# EAGLE design Versie 5 (EAGLE 7.3.0)

## Sheet 1 of 7: OVERVIEW
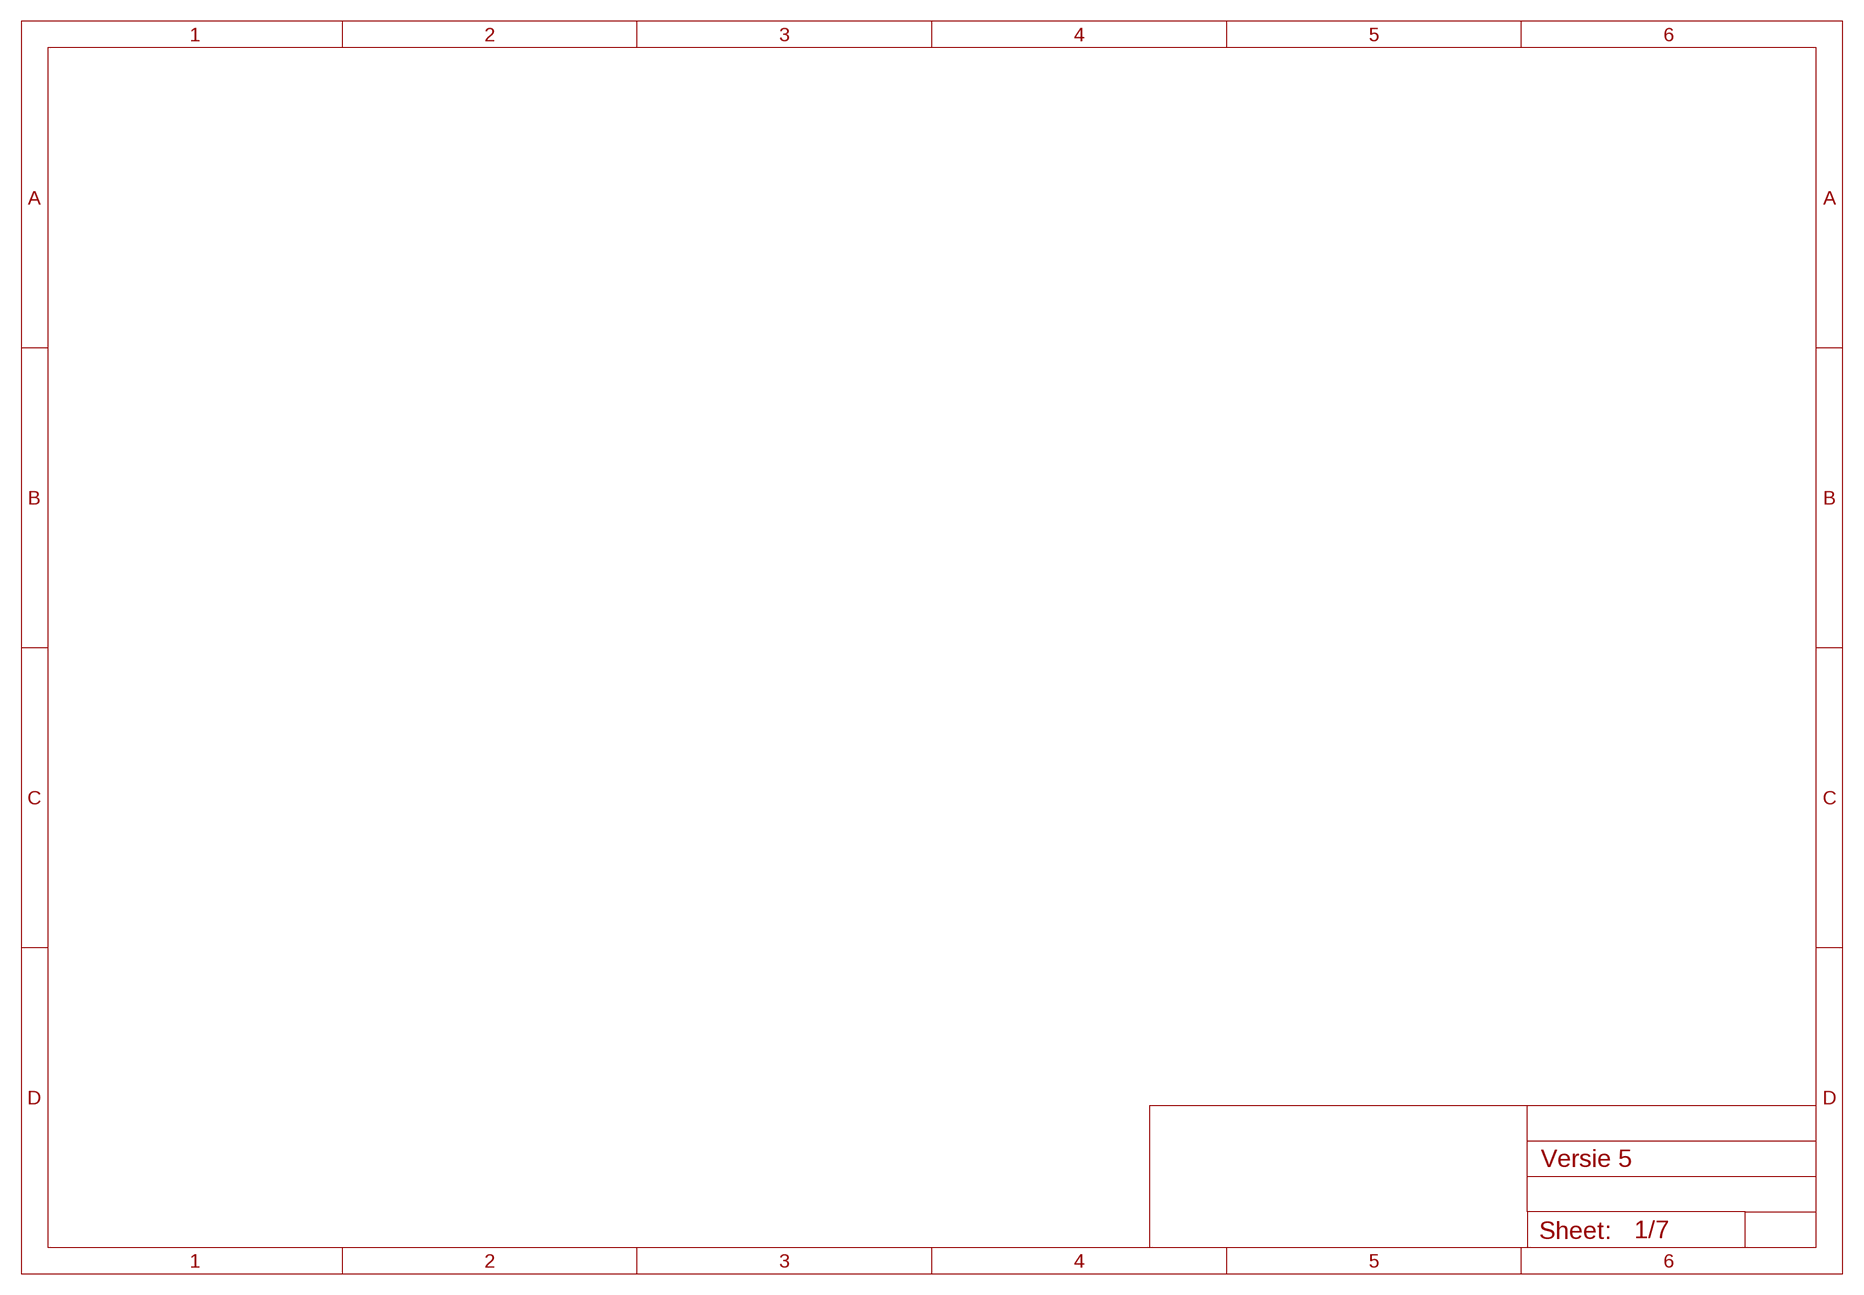
[diagram p0: schematic, sheet 1]

## Sheet 2 of 7: POWER
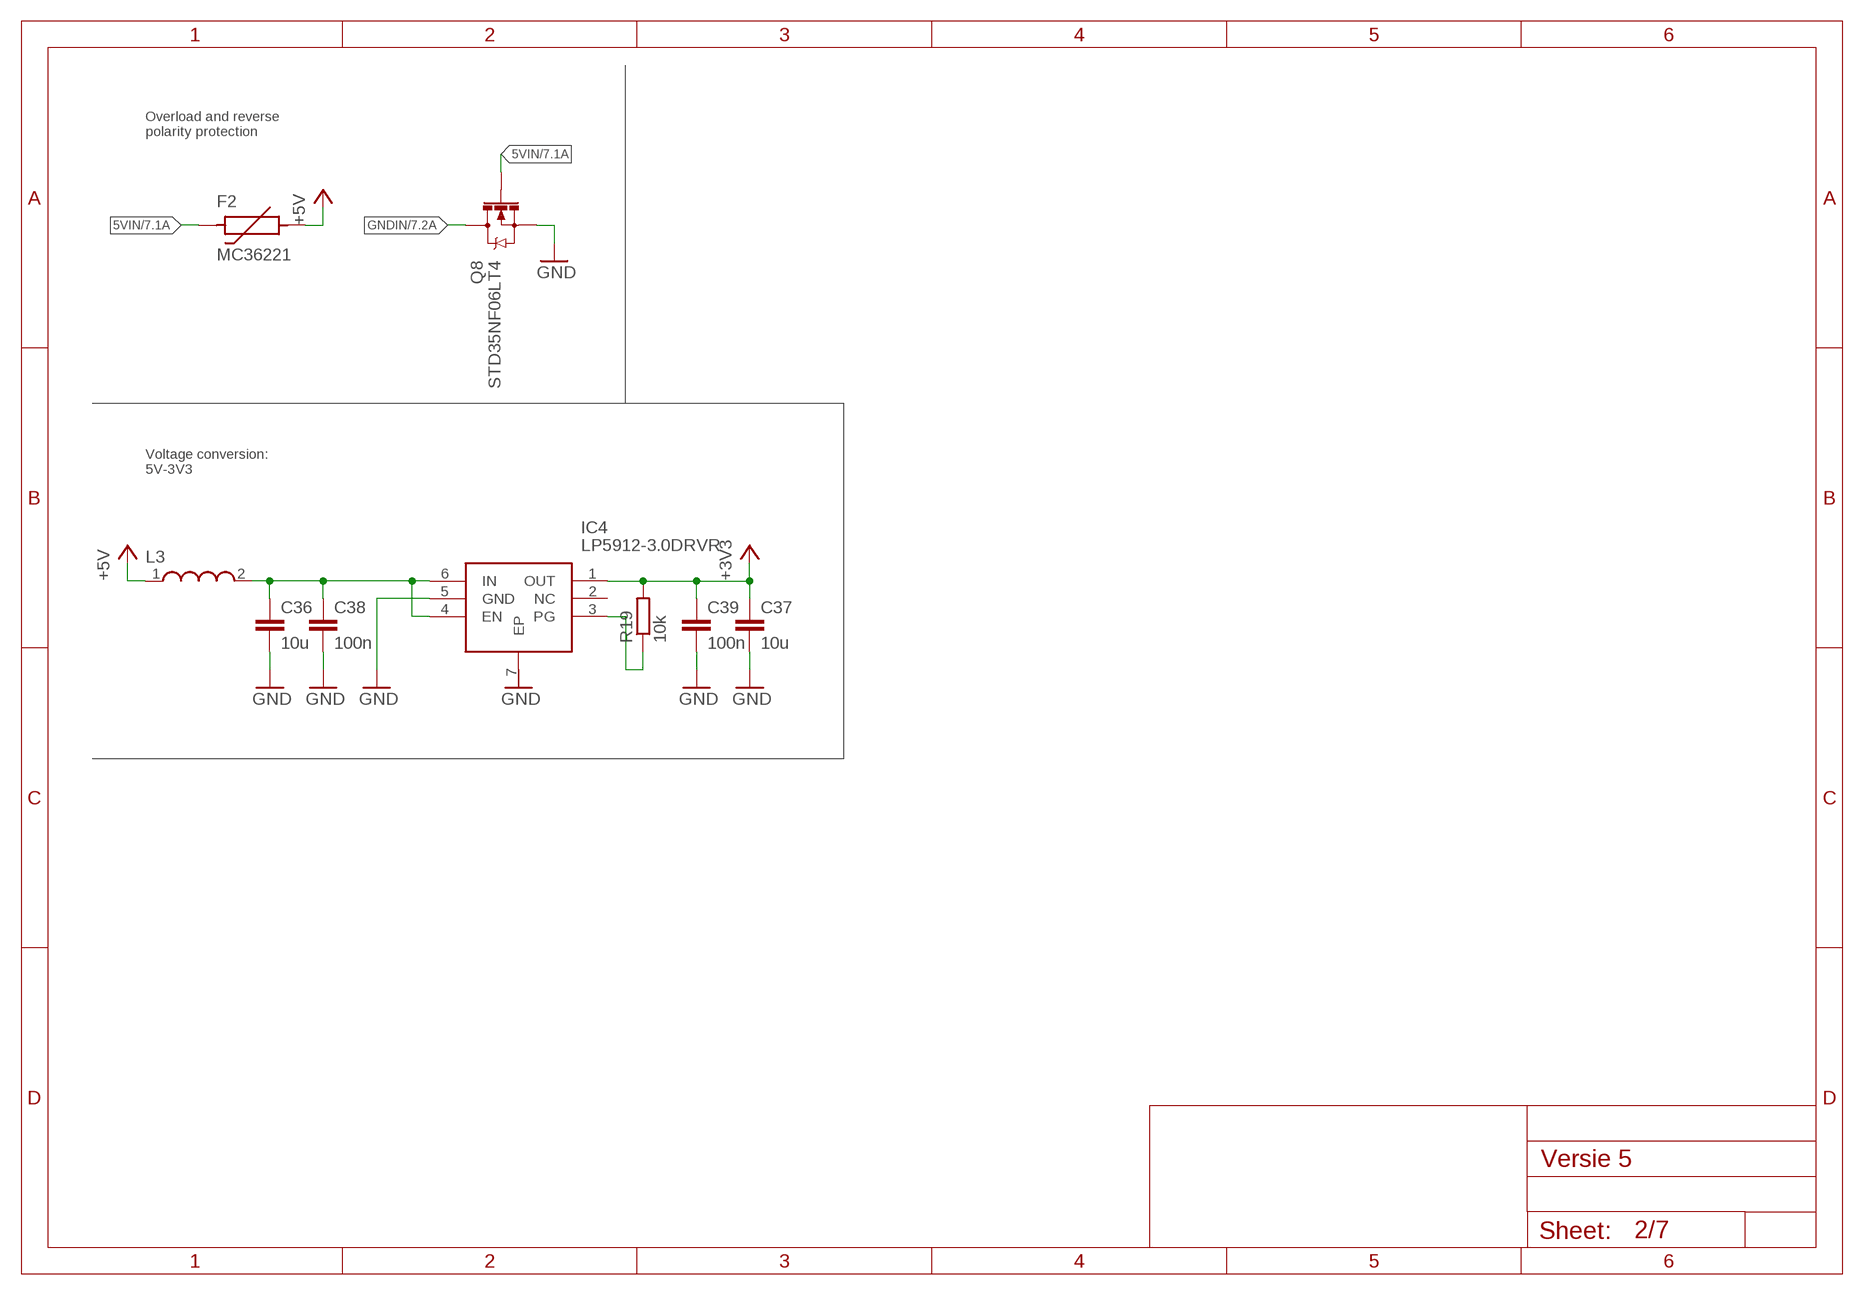
[diagram p1: schematic, sheet 2]

### Parts
C36  10u  C-EUC0603  [C0603]
C37  10u  C-EUC0603  [C0603]
C38  100n  C-EUC0603  [C0603]
C39  100n  C-EUC0603  [C0603]
F2  MC36221  [1206]
IC4  LP5912-3.0DRVR  [SON65P200X200X80-7N]
L3  WE-CBA_0603(WB/HS)  [WE-CBA_0603(W=2.2)]
Q8  STD35NF06LT4  MOSFET-NCHANNEL_SOT23-3  [SOT23-3]
R19  10k  R-EU_R0603  [R0603]

### Nets
5VIN: F2.P$1 Q8.1(G) ; also sheet 7
+3V3: C37.1 C39.1 IC4.1(OUT) R19.2 ; also sheet 3,4,5,6,7
+5V: F2.P$2 L3.1
GND: C36.2 C37.2 C38.2 C39.2 IC4.5(GND) Q8.2(S) ; also sheet 3,4,5,6,7
GNDIN: Q8.3(D) ; also sheet 7
N$28: C36.1 C38.1 IC4.4(EN) IC4.6(IN) L3.2
N$29: IC4.3(PG) R19.1
Unconnected: IC4.2(NC) IC4.7(EP)

### Notes on the sheet
- Overload and reverse
  polarity protection
- Voltage conversion:
  5V-3V3

## Sheet 3 of 7: PPS IN
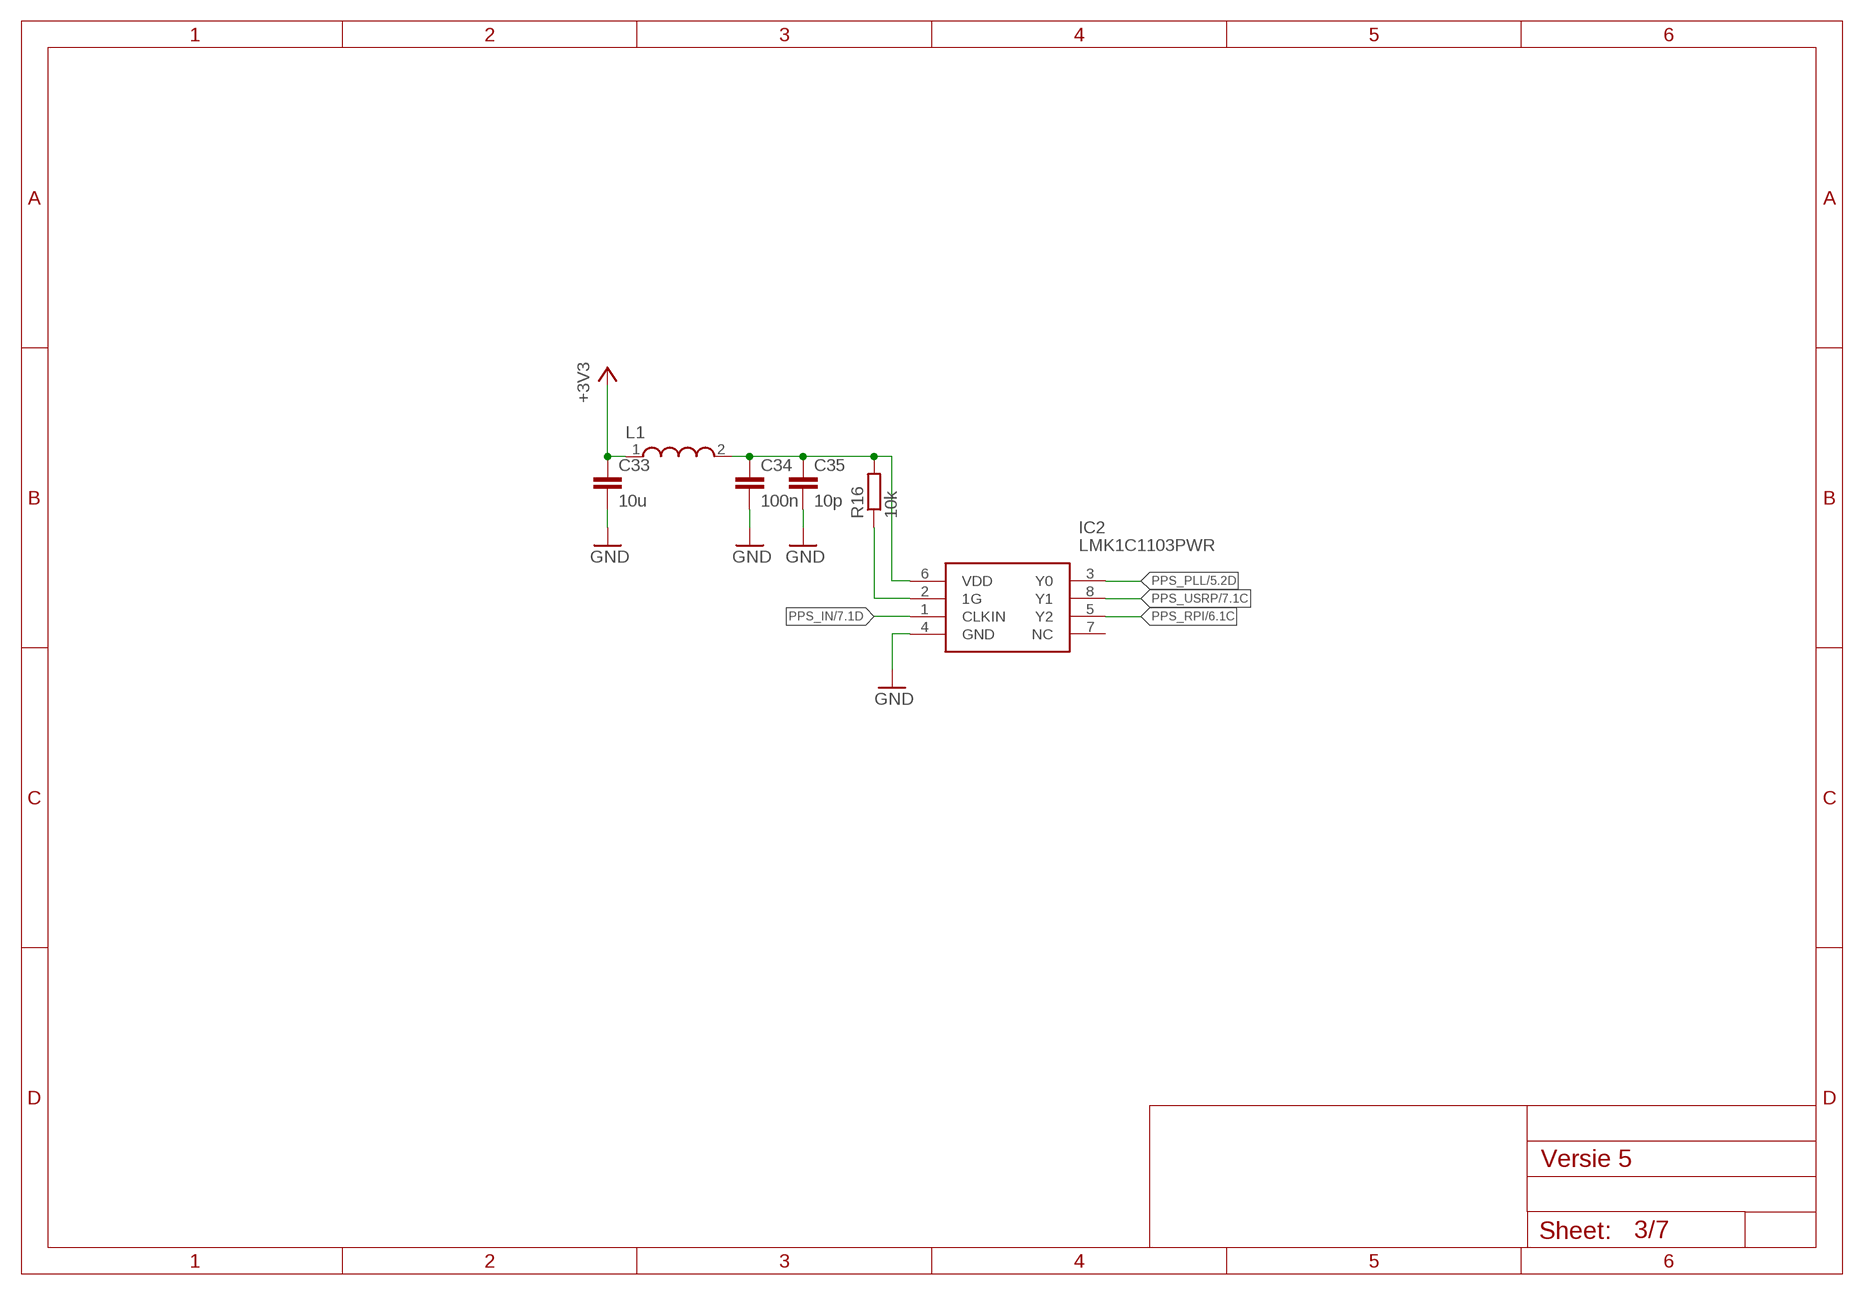
[diagram p2: schematic, sheet 3]

### Parts
C33  10u  C-EUC0603  [C0603]
C34  100n  C-EUC0603  [C0603]
C35  10p  C-EUC0603  [C0603]
IC2  LMK1C1103PWR  [SOP65P640X120-8N]
L1  WE-CBA_0603(WB/HS)  [WE-CBA_0603(W=2.2)]
R16  10k  R-EU_R0603  [R0603]

### Nets
+3V3: C33.1 L1.1 ; also sheet 2,4,5,6,7
GND: C33.2 C34.2 C35.2 IC2.4(GND) ; also sheet 2,4,5,6,7
N$22: IC2.2(1G) R16.1
N$24: C34.1 C35.1 IC2.6(VDD) L1.2 R16.2
PPS_IN: IC2.1(CLKIN) ; also sheet 7
PPS_PLL: IC2.3(Y0) ; also sheet 5
PPS_RPI: IC2.5(Y2) ; also sheet 6,7
PPS_USRP: IC2.8(Y1) ; also sheet 7
Unconnected: IC2.7(NC)

## Sheet 4 of 7: 10MHz IN
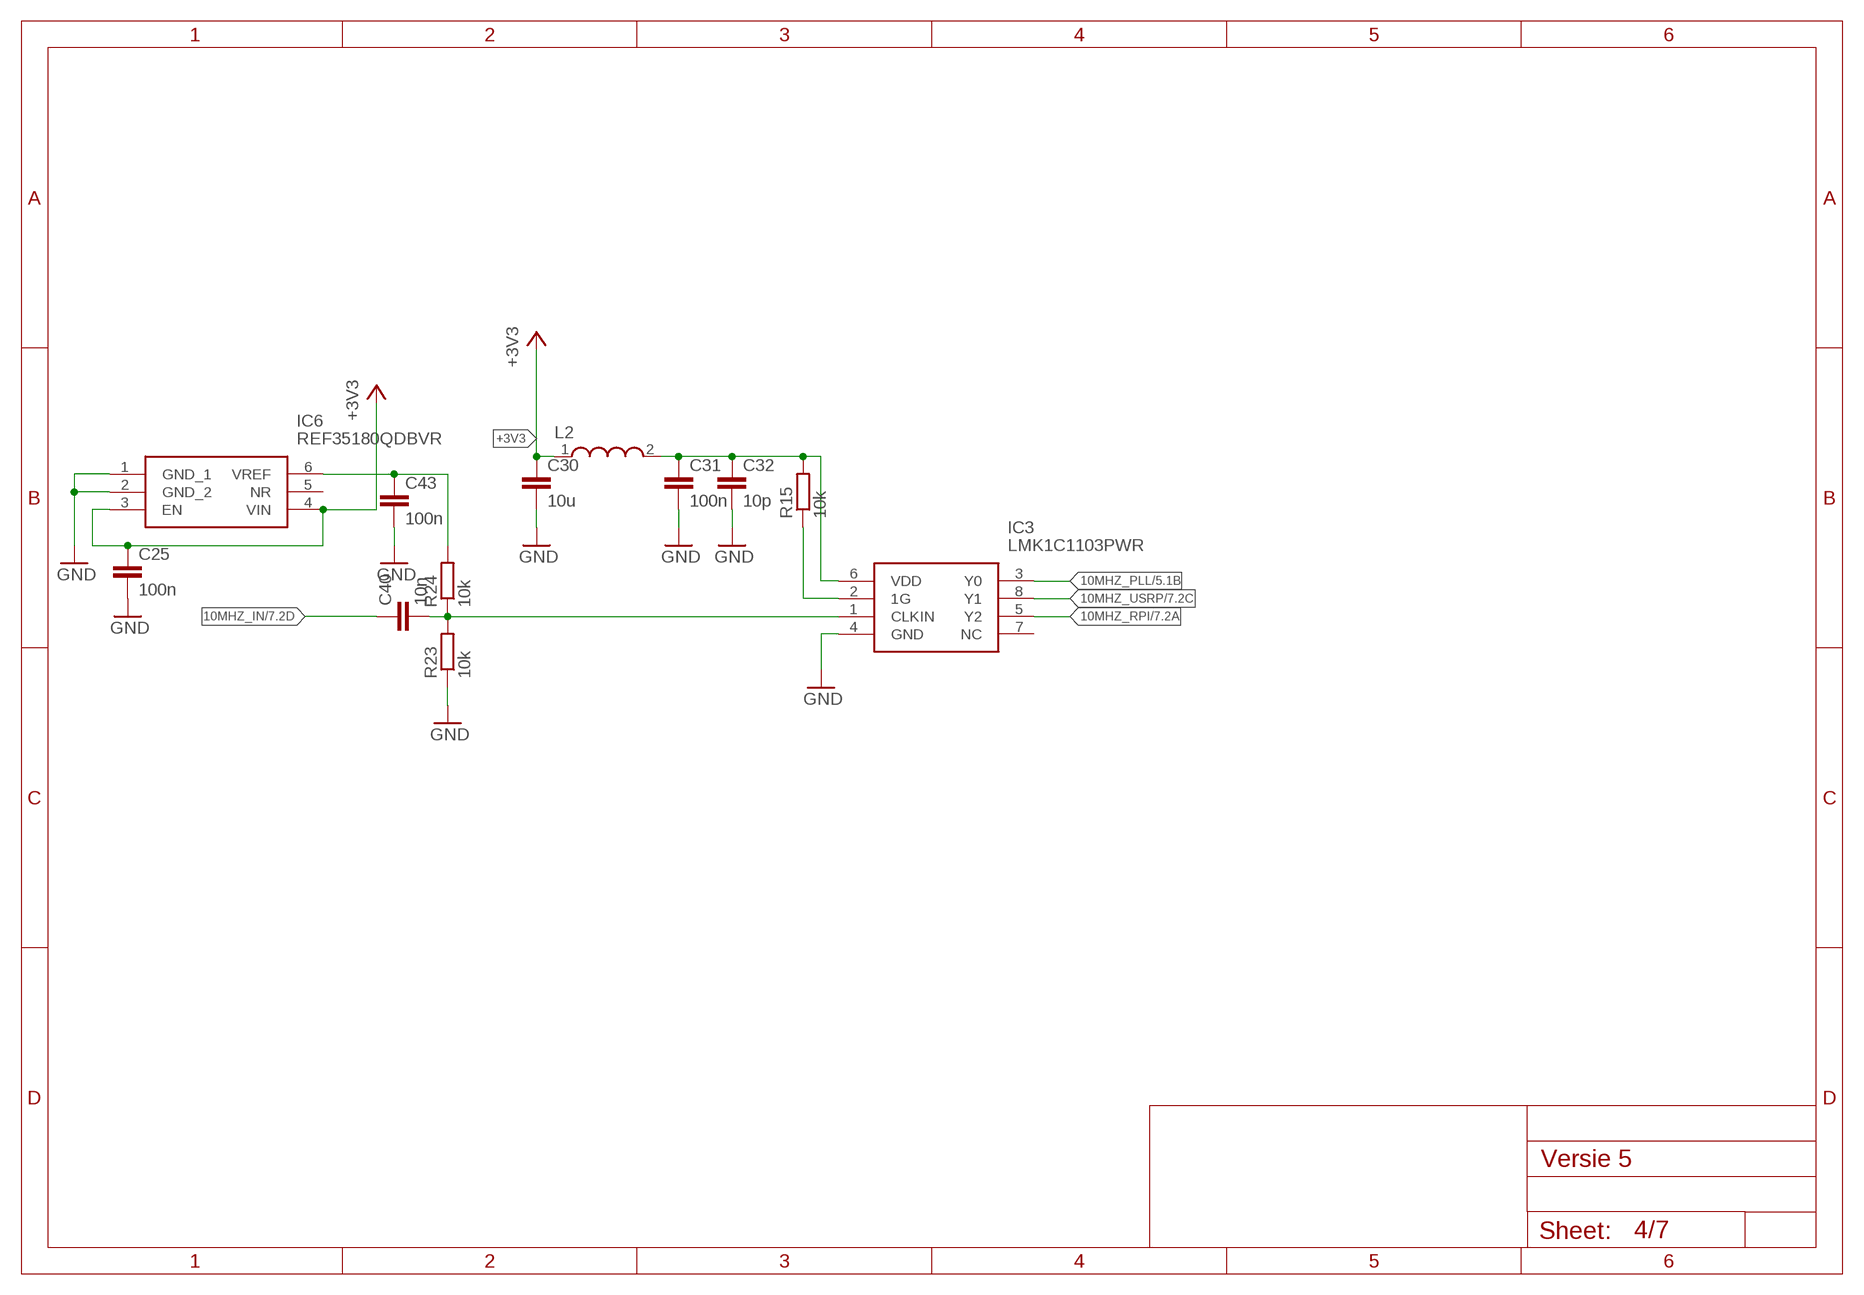
[diagram p3: schematic, sheet 4]

### Parts
C25  100n  C-EUC0603  [C0603]
C30  10u  C-EUC0603  [C0603]
C31  100n  C-EUC0603  [C0603]
C32  10p  C-EUC0603  [C0603]
C40  10n  C-EUC0603  [C0603]
C43  100n  C-EUC0603  [C0603]
IC3  LMK1C1103PWR  [SOP65P640X120-8N]
IC6  REF35180QDBVR  [SOT95P280X145-6N]
L2  WE-CBA_0603(WB/HS)  [WE-CBA_0603(W=2.2)]
R15  10k  R-EU_R0603  [R0603]
R23  10k  R-EU_R0603  [R0603]
R24  10k  R-EU_R0603  [R0603]

### Nets
10MHZ_IN: C40.1 ; also sheet 7
10MHZ_PLL: IC3.3(Y0) ; also sheet 5
10MHZ_RPI: IC3.5(Y2) ; also sheet 7
10MHZ_USRP: IC3.8(Y1) ; also sheet 7
+3V3: C25.1 C30.1 IC6.3(EN) IC6.4(VIN) L2.1 ; also sheet 2,3,5,6,7
GND: C25.2 C30.2 C31.2 C32.2 C43.2 IC3.4(GND) IC6.1(GND_1) IC6.2(GND_2) R23.1 ; also sheet 2,3,5,6,7
N$23: C40.2 IC3.1(CLKIN) R23.2 R24.1
N$25: IC3.2(1G) R15.1
N$27: C31.1 C32.1 IC3.6(VDD) L2.2 R15.2
N$30: C43.1 IC6.6(VREF) R24.2
Unconnected: IC3.7(NC) IC6.5(NR)

## Sheet 5 of 7: PLL
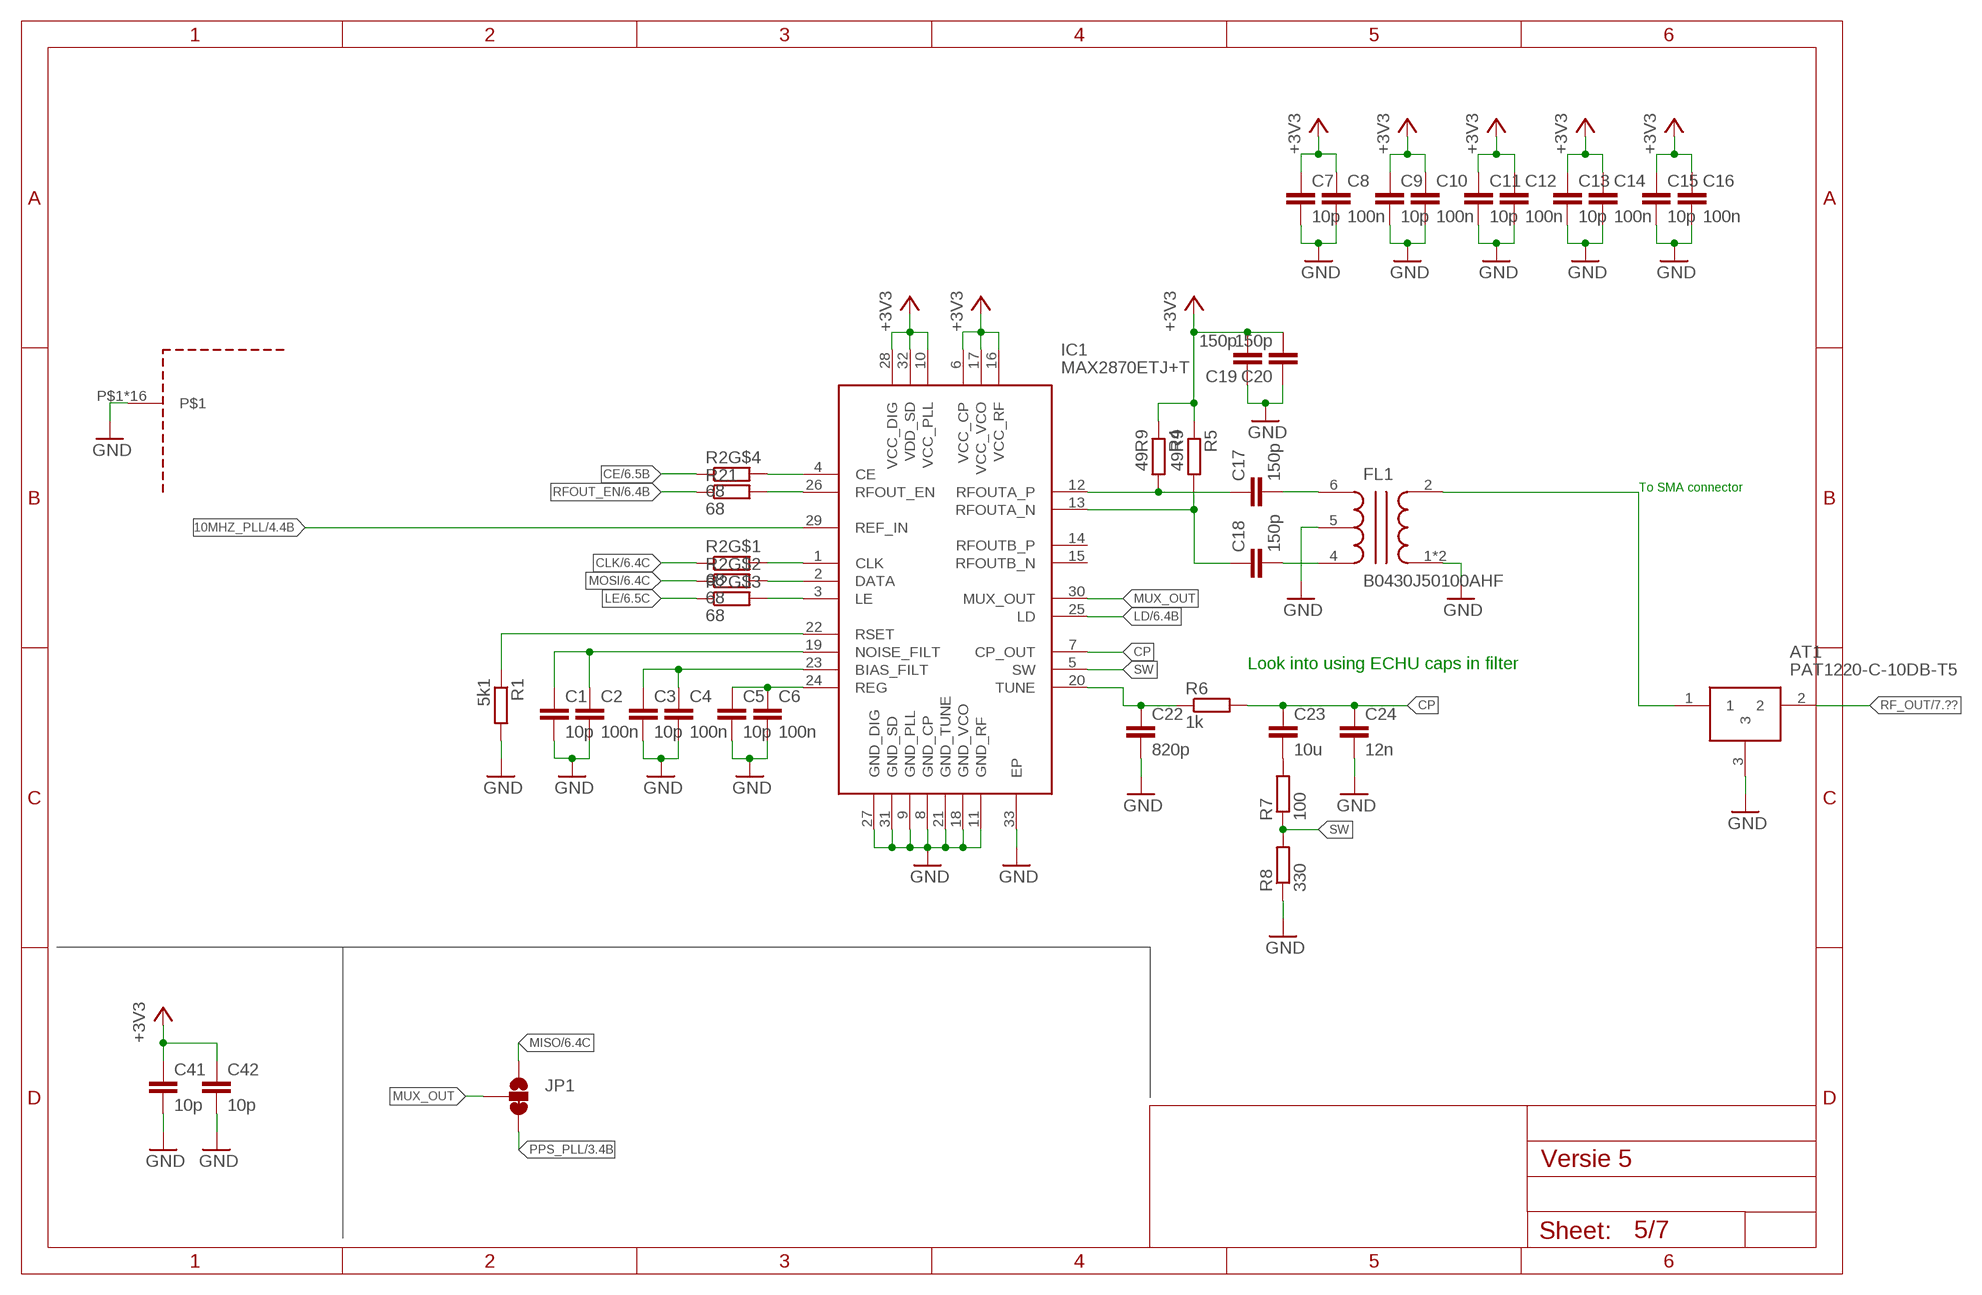
[diagram p4: schematic, sheet 5]

### Parts
AT1  PAT1220-C-10DB-T5  [PAT1220C10DBT5]
C1  10p  C-EUC0603  [C0603]
C2  100n  C-EUC0603  [C0603]
C3  10p  C-EUC0603  [C0603]
C4  100n  C-EUC0603  [C0603]
C5  10p  C-EUC0603  [C0603]
C6  100n  C-EUC0603  [C0603]
C7  10p  C-EUC0603  [C0603]
C8  100n  C-EUC0603  [C0603]
C9  10p  C-EUC0603  [C0603]
C10  100n  C-EUC0603  [C0603]
C11  10p  C-EUC0603  [C0603]
C12  100n  C-EUC0603  [C0603]
C13  10p  C-EUC0603  [C0603]
C14  100n  C-EUC0603  [C0603]
C15  10p  C-EUC0603  [C0603]
C16  100n  C-EUC0603  [C0603]
C17  150p  C-EUC0402  [C0402]
C18  150p  C-EUC0402  [C0402]
C19  150p  C-EUC0402  [C0402]
C20  150p  C-EUC0402  [C0402]
C22  820p  C-EUC0603  [C0603]
C23  10u  C-EUC0603  [C0603]
C24  12n  C-EUC0603  [C0603]
C41  10p  C-EUC0603  [C0603]
C42  10p  C-EUC0603  [C0603]
FL1  B0430J50100AHF  [B0430J50100AHF]
IC1  MAX2870ETJ+T  [QFN50P500X500X80-33N]
JP1  JUMPER-SMT_3_1-NC_TRACE_SILK  [SMT-JUMPER_3_1-NC_TRACE_SILK]
R1  5k1  R-EU_R0603  [R0603]
R2  68  CAY16A-2002F4LF  [CAY16A1003F4LF]
R4  49R9  R-EU_R0402  [R0402]
R5  49R9  R-EU_R0402  [R0402]
R6  1k  R-EU_R0603  [R0603]
R7  100  R-EU_R0603  [R0603]
R8  330  R-EU_R0603  [R0603]
R21  68  R-EU_R0603  [R0603]
U$1  BMI-S-209-F-20-R  [BMI-S-209-F-20-R]

### Nets
10MHZ_PLL: IC1.29(REF_IN) ; also sheet 4
+3V3: C7.1 C8.1 C9.1 C10.1 C11.1 C12.1 C13.1 C14.1 C15.1 C16.1 C19.2 C20.2 C41.1 C42.1 IC1.6(VCC_CP) IC1.10(VCC_PLL) IC1.16(VCC_RF) IC1.17(VCC_VCO) IC1.28(VCC_DIG) IC1.32(VDD_SD) R4.1 R5.1 ; also sheet 2,3,4,6,7
CE: R2.4 ; also sheet 6
CLK: R2.1 ; also sheet 6
CP: C23.1 C24.1 IC1.7(CP_OUT) R6.2
GND: AT1.3 C1.2 C2.2 C3.2 C4.2 C5.2 C6.2 C7.2 C8.2 C9.2 C10.2 C11.2 C12.2 C13.2 C14.2 C15.2 C16.2 C19.1 C20.1 C22.2 C24.2 C41.2 C42.2 FL1.1(GND_1) FL1.3(GND_1) FL1.5(NC) IC1.8(GND_CP) IC1.9(GND_PLL) IC1.11(GND_RF) IC1.18(GND_VCO) IC1.21(GND_TUNE) IC1.27(GND_DIG) IC1.31(GND_SD) IC1.33(EP) R1.2 R8.1 U$1.P$1 U$1.P$2 U$1.P$3 U$1.P$4 U$1.P$5 U$1.P$6 U$1.P$7 U$1.P$8 U$1.P$9 U$1.P$10 U$1.P$11 U$1.P$12 U$1.P$13 U$1.P$14 U$1.P$15 U$1.P$16 ; also sheet 2,3,4,6,7
LD: IC1.25(LD) ; also sheet 6
LE: R2.3 ; also sheet 6
MISO: JP1.1 ; also sheet 6
MOSI: R2.2 ; also sheet 6
MUX_OUT: IC1.30(MUX_OUT) JP1.2
N$1: C5.1 C6.1 IC1.24(REG)
N$2: IC1.22(RSET) R1.1
N$3: IC1.1(CLK) R2.8
N$4: IC1.2(DATA) R2.7
N$5: IC1.3(LE) R2.6
N$6: C1.1 C2.1 IC1.19(NOISE_FILT)
N$7: C3.1 C4.1 IC1.23(BIAS_FILT)
N$8: IC1.26(RFOUT_EN) R21.2
N$9: IC1.4(CE) R2.5
N$10: C22.1 IC1.20(TUNE) R6.1
N$12: C17.1 IC1.12(RFOUTA_P) R4.2
N$13: C18.1 IC1.13(RFOUTA_N) R5.2
N$14: C18.2 FL1.4(BALANCED_PORT_1)
N$15: C17.2 FL1.6(BALANCED_PORT_2)
N$16: C23.2 R7.2
N$18: AT1.1 FL1.2(UNBALANCED)
PPS_PLL: JP1.3 ; also sheet 3
RF_OUT: AT1.2 ; also sheet 7
RFOUT_EN: R21.1 ; also sheet 6
SW: IC1.5(SW) R7.1 R8.2
Unconnected: IC1.14(RFOUTB_P) IC1.15(RFOUTB_N)

### Notes on the sheet
- To SMA connector
- Look into using ECHU caps in filter

## Sheet 6 of 7: MCU
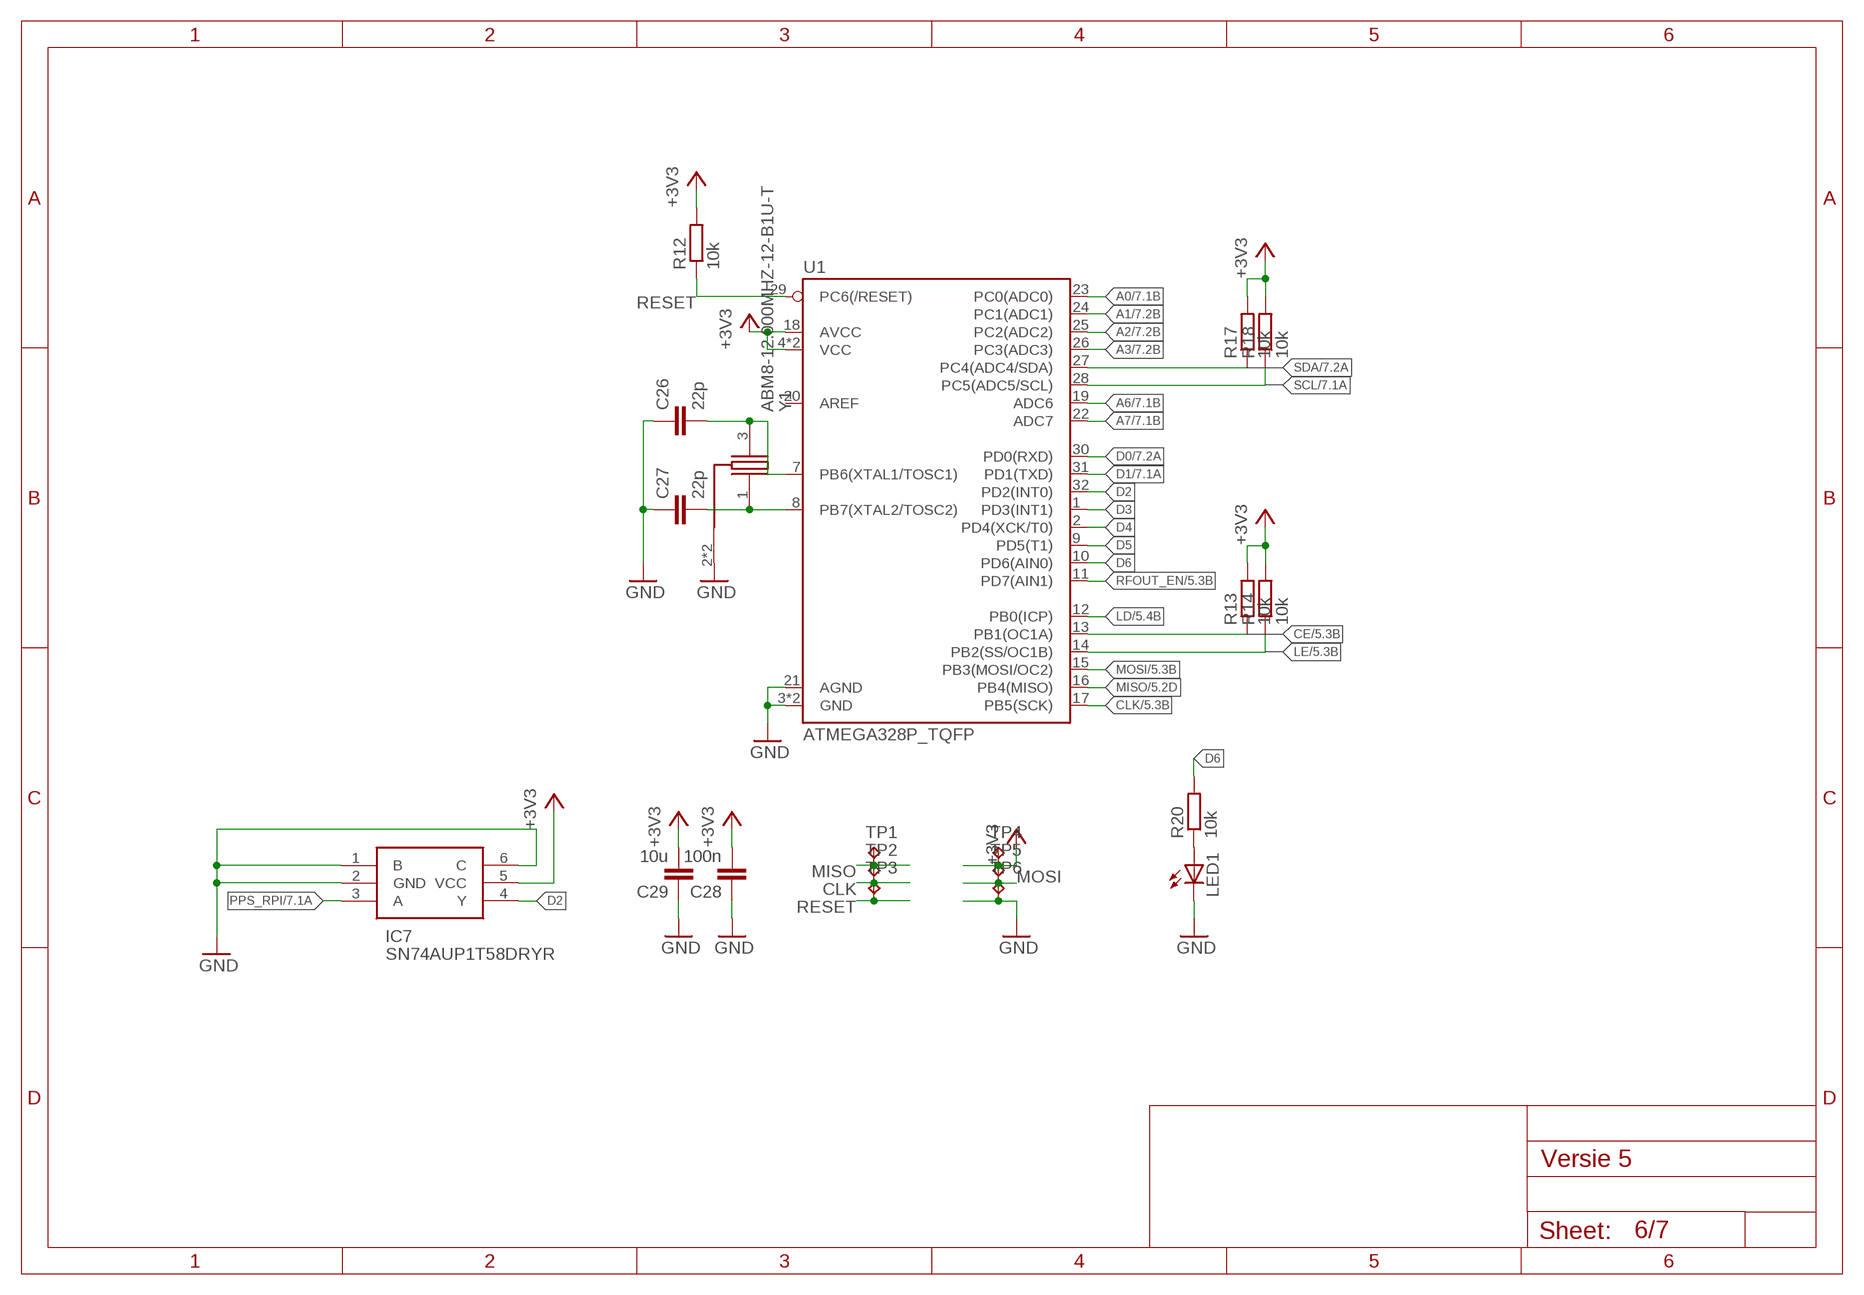
[diagram p5: schematic, sheet 6]

### Parts
C26  22p  C-EUC0603  [C0603]
C27  22p  C-EUC0603  [C0603]
C28  100n  C-EUC0603  [C0603]
C29  10u  C-EUC0603  [C0603]
IC7  SN74AUP1T58DRYR  [SON50P100X145X60-6N]
LED1  LEDCHIPLED_0805  [CHIPLED_0805]
R12  10k  R-EU_R0603  [R0603]
R13  10k  R-EU_R0603  [R0603]
R14  10k  R-EU_R0603  [R0603]
R17  10k  R-EU_R0603  [R0603]
R18  10k  R-EU_R0603  [R0603]
R20  10k  R-EU_R0603  [R0603]
TP1  TPTP16R  [TP16R]
TP2  TPTP16R  [TP16R]
TP3  TPTP16R  [TP16R]
TP4  TPTP16R  [TP16R]
TP5  TPTP16R  [TP16R]
TP6  TPTP16R  [TP16R]
U1  ATMEGA328P_TQFP  [TQFP32-08]
Y1  ABM8-12.000MHZ-12-B1U-T  [ABM810000MHZ12D2W]

### Nets
+3V3: C28.2 C29.2 IC7.5(VCC) R12.2 R13.2 R14.2 R17.2 R18.2 TP4.TP U1.4(VCC) U1.6(VCC) U1.18(AVCC) ; also sheet 2,3,4,5,7
A0: U1.23(PC0(ADC0)) ; also sheet 7
A1: U1.24(PC1(ADC1)) ; also sheet 7
A2: U1.25(PC2(ADC2)) ; also sheet 7
A3: U1.26(PC3(ADC3)) ; also sheet 7
A6: U1.19(ADC6) ; also sheet 7
A7: U1.22(ADC7) ; also sheet 7
CE: R13.1 U1.13(PB1(OC1A)) ; also sheet 5
CLK: TP2.TP U1.17(PB5(SCK)) ; also sheet 5
D0: U1.30(PD0(RXD)) ; also sheet 7
D1: U1.31(PD1(TXD)) ; also sheet 7
D2: IC7.4(Y) U1.32(PD2(INT0))
D3: U1.1(PD3(INT1))
D4: U1.2(PD4(XCK/T0))
D5: U1.9(PD5(T1))
D6: R20.2 U1.10(PD6(AIN0))
GND: C26.1 C27.1 C28.1 C29.1 IC7.1(B) IC7.2(GND) IC7.6(C) LED1.C TP6.TP U1.3(GND) U1.5(GND) U1.21(AGND) Y1.2(GND_1) Y1.4(GND_1) ; also sheet 2,3,4,5,7
LD: U1.12(PB0(ICP)) ; also sheet 5
LE: R14.1 U1.14(PB2(SS/OC1B)) ; also sheet 5
MISO: TP1.TP U1.16(PB4(MISO)) ; also sheet 5
MOSI: TP5.TP U1.15(PB3(MOSI/OC2)) ; also sheet 5
N$19: LED1.A R20.1
N$20: C26.2 U1.7(PB6(XTAL1/TOSC1)) Y1.3(X2)
N$21: C27.2 U1.8(PB7(XTAL2/TOSC2)) Y1.1(X1)
PPS_RPI: IC7.3(A) ; also sheet 3,7
RESET: R12.1 TP3.TP U1.29(PC6(/RESET))
RFOUT_EN: U1.11(PD7(AIN1)) ; also sheet 5
SCL: R18.1 U1.28(PC5(ADC5/SCL)) ; also sheet 7
SDA: R17.1 U1.27(PC4(ADC4/SDA)) ; also sheet 7
Unconnected: U1.20(AREF)

## Sheet 7 of 7: CONNECTORS
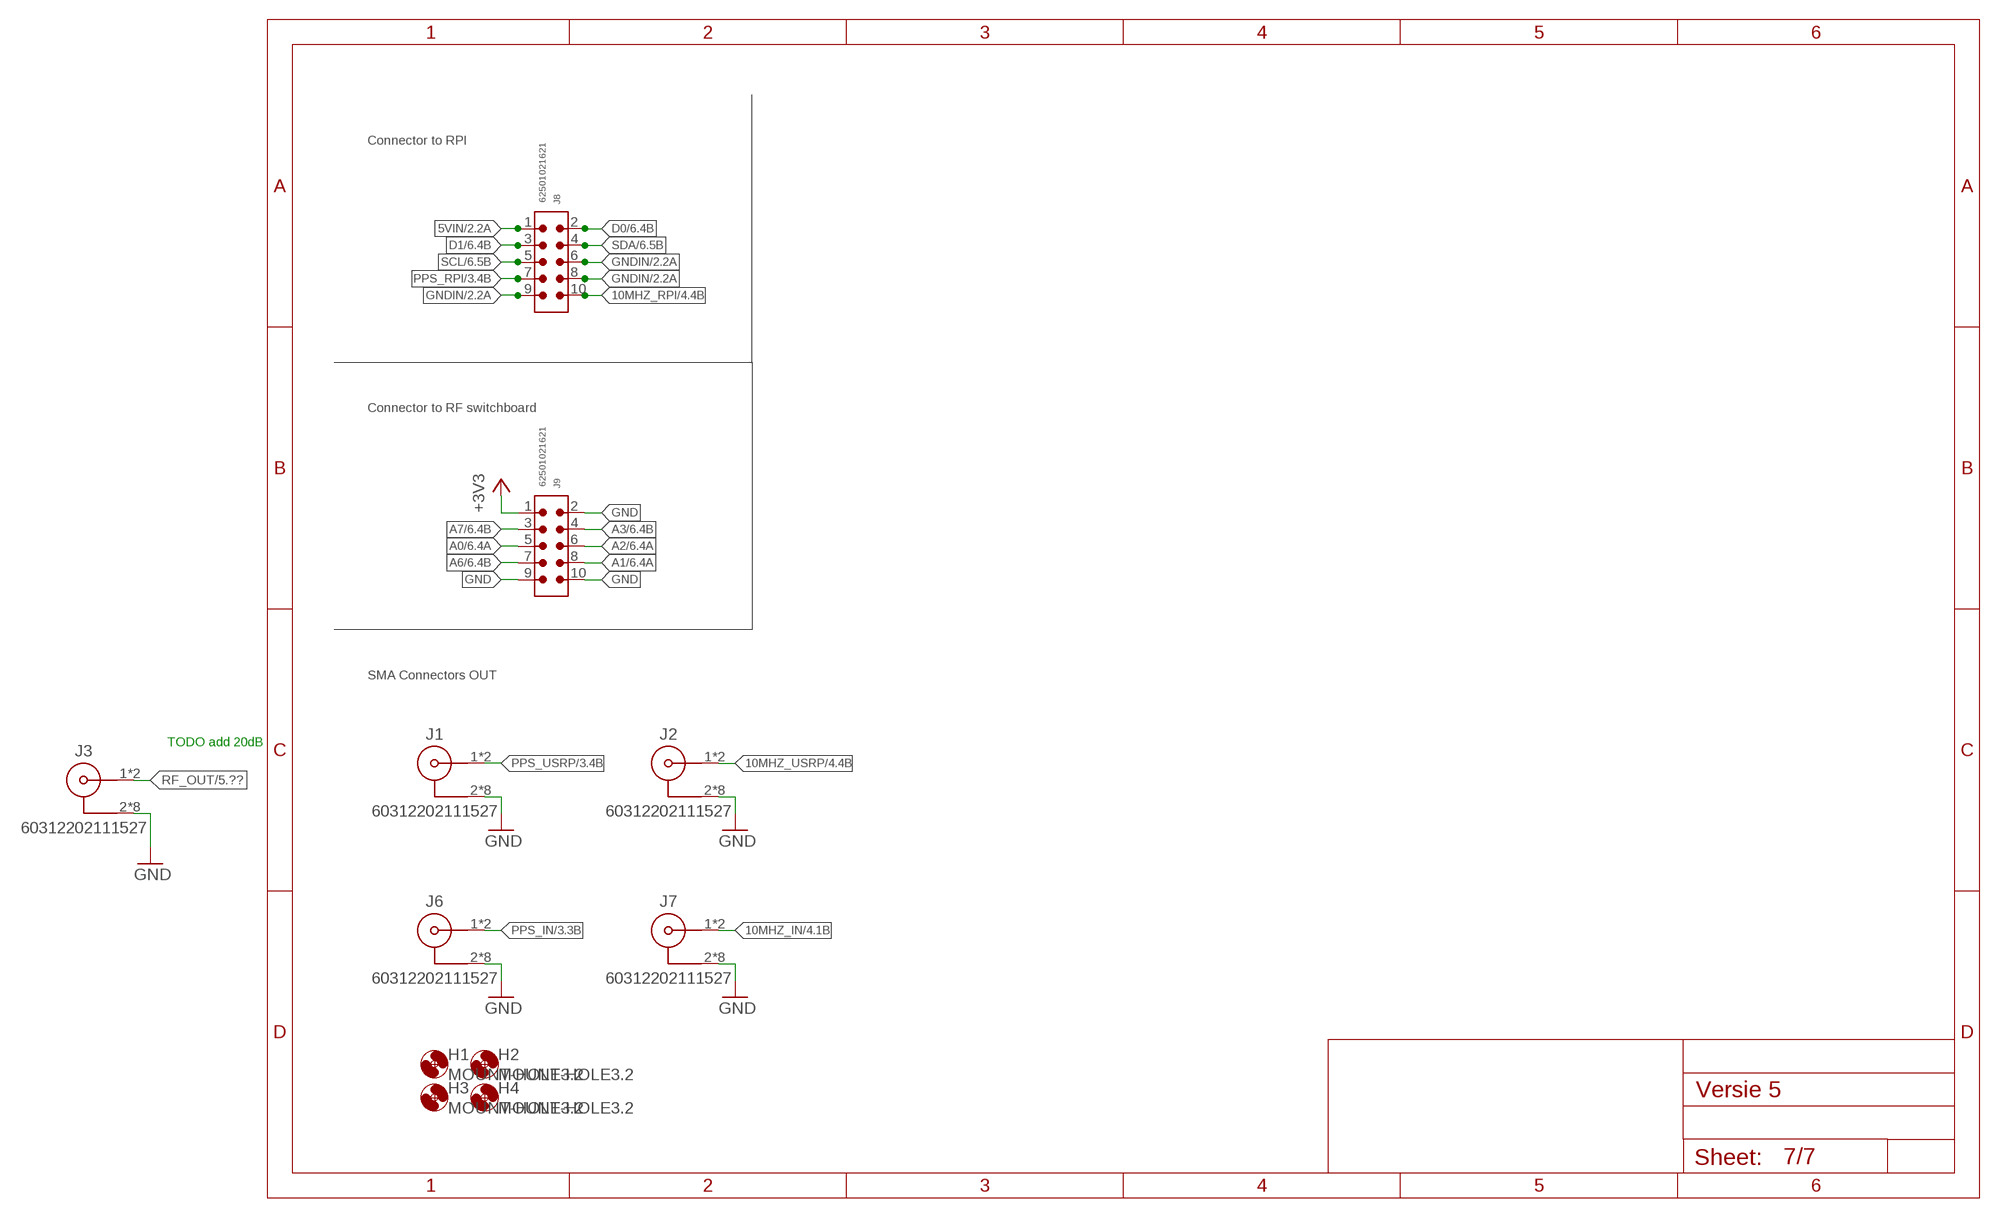
[diagram p6: schematic, sheet 7]

### Parts
H1  MOUNT-HOLE3.2  [3,2]
H2  MOUNT-HOLE3.2  [3,2]
H3  MOUNT-HOLE3.2  [3,2]
H4  MOUNT-HOLE3.2  [3,2]
J1  60312202111527  [60312202111527]
J2  60312202111527  [60312202111527]
J3  60312202111527  [60312202111527]
J6  60312202111527  [60312202111527]
J7  60312202111527  [60312202111527]
J8  62501021621  6250XX21621_62501021621  [62501021621]
J9  62501021621  6250XX21621_62501021621  [62501021621]

### Nets
5VIN: J8.1 ; also sheet 2
10MHZ_IN: J7.1 J7.6 ; also sheet 4
10MHZ_RPI: J8.10 ; also sheet 4
10MHZ_USRP: J2.1 J2.6 ; also sheet 4
+3V3: J9.1 ; also sheet 2,3,4,5,6
A0: J9.5 ; also sheet 6
A1: J9.8 ; also sheet 6
A2: J9.6 ; also sheet 6
A3: J9.4 ; also sheet 6
A6: J9.7 ; also sheet 6
A7: J9.3 ; also sheet 6
D0: J8.2 ; also sheet 6
D1: J8.3 ; also sheet 6
GND: J1.2 J1.3 J1.4 J1.5 J1.7 J1.8 J1.9 J1.10 J2.2 J2.3 J2.4 J2.5 J2.7 J2.8 J2.9 J2.10 J3.2 J3.3 J3.4 J3.5 J3.7 J3.8 J3.9 J3.10 J6.2 J6.3 J6.4 J6.5 J6.7 J6.8 J6.9 J6.10 J7.2 J7.3 J7.4 J7.5 J7.7 J7.8 J7.9 J7.10 J9.2 J9.9 J9.10 ; also sheet 2,3,4,5,6
GNDIN: J8.6 J8.8 J8.9 ; also sheet 2
PPS_IN: J6.1 J6.6 ; also sheet 3
PPS_RPI: J8.7 ; also sheet 3,6
PPS_USRP: J1.1 J1.6 ; also sheet 3
RF_OUT: J3.1 J3.6 ; also sheet 5
SCL: J8.5 ; also sheet 6
SDA: J8.4 ; also sheet 6

### Notes on the sheet
- Connector to RPI
- Connector to RF switchboard
- SMA Connectors OUT
- TODO add 20dB

## Library data of the parts
AT1 = 20dB atten:PAT1220-C-10DB-T5: Attenuators 10dB 50ohm Source: Datasheet <https://www.susumu.co.jp/common/pdf/n_catalog_partition16_en.pdf>; DESCRIPTION: Attenuators 10dB 50ohm; HEIGHT: 0.5mm; MANUFACTURER_NAME: Susumu; MANUFACTURER_PART_NUMBER: PAT1220-C-10DB-T5; MOUSER_PART_NUMBER: 754-PAT1220C10DBT5; MOUSER_PRICE-STOCK: https://www.mouser.co.uk/ProductDetail/Susumu/PAT1220-C-10DB-T5?qs=y7y%2FNpWpM9lj1vyxysVZ0Q%3D%3D
C1-C20 C22-C43 = rcl:C-EU: CAPACITOR, European symbol
F2 = multicomp-resettable-fuse:MC36221
FL1 = balun:B0430J50100AHF: Signal Conditioning 400-3000MHz 50/100 Ohm IL=4.0dB Source: Datasheet <https://componentsearchengine.com/Datasheets/1/B0430J50100AHF.pdf>; DESCRIPTION: Signal Conditioning 400-3000MHz 50/100 Ohm IL=4.0dB; HEIGHT: 0.7mm; MANUFACTURER_NAME: ANAREN; MANUFACTURER_PART_NUMBER: B0430J50100AHF; MOUSER_PART_NUMBER: 620-B0430J50100AHF; MOUSER_PRICE-STOCK: https://www.mouser.co.uk/ProductDetail/Anaren/B0430J50100AHF?qs=61pwXRo0i5hJ5yOyYTWnSA%3D%3D
H1-H4 = holes:MOUNT-HOLE: MOUNTING HOLE with drill center marker
IC1 = max2870:MAX2870ETJ+T: Phase Locked Loops - PLL PLL/VCO Source: Datasheet <https://datasheets.maximintegrated.com/en/ds/MAX2870.pdf>; DESCRIPTION: Phase Locked Loops - PLL PLL/VCO; HEIGHT: 0.8mm; MANUFACTURER_NAME: Analog Devices; MANUFACTURER_PART_NUMBER: MAX2870ETJ+T; MOUSER_PART_NUMBER: 700-MAX2870ETJ+T; MOUSER_PRICE-STOCK: https://www.mouser.co.uk/ProductDetail/Analog-Devices-Maxim-Integrated/MAX2870ETJ%2bT?qs=UFD7vfw3J8rIUAsp8guXHg%3D%3D
IC2 IC3 = lmk1c110x:LMK1C1103PWR: Clock Buffer 3-channel output LVCMOS 1.8-V buffer 8-TSSOP -40 to 125 Source: Datasheet <https://www.ti.com/lit/ds/symlink/lmk1c1103.pdf?ts=1603742885821&ref_url=https%3A%2F%2Fwww.ti.com%2Fproduct%2FLMK1C1103>; DESCRIPTION: Clock Buffer 3-channel output LVCMOS 1.8-V buffer 8-TSSOP -40 to 125; HEIGHT: 1.2mm; MANUFACTURER_NAME: Texas Instruments; MANUFACTURER_PART_NUMBER: LMK1C1103PWR; MOUSER_PART_NUMBER: 595-LMK1C1103PWR; MOUSER_PRICE-STOCK: https://www.mouser.co.uk/ProductDetail/Texas-Instruments/LMK1C1103PWR?qs=rI7uf1IzohQWIx%2FERNzyRA%3D%3D
IC4 = lp5912:LP5912-3.0DRVR: 500-mA low-noise low-IQ low-dropout (LDO) linear regulator Source: Datasheet <http://www.ti.com/lit/gpn/lp5912>; DESCRIPTION: 500-mA low-noise low-IQ low-dropout (LDO) linear regulator; HEIGHT: 0.8mm; MANUFACTURER_NAME: Texas Instruments; MANUFACTURER_PART_NUMBER: LP5912-3.0DRVR; MOUSER_PART_NUMBER: 595-LP5912-3.0DRVR; MOUSER_PRICE-STOCK: https://www.mouser.co.uk/ProductDetail/Texas-Instruments/LP5912-3.0DRVR?qs=yBt6ao%2FxsTzuXuKE9NcTCg%3D%3D
IC6 = voltage-ref:REF35180QDBVR: Voltage References 650-nA quiescent current, 12-ppm/C drift, ultra-low-power precision voltage reference Source: Datasheet <https://www.arrow.com/en/products/ref35180qdbvr/texas-instruments?region=nac>; DESCRIPTION: Voltage References 650-nA quiescent current, 12-ppm/C drift, ultra-low-power precision voltage reference; HEIGHT: 1.45mm; MANUFACTURER_NAME: Texas Instruments; MANUFACTURER_PART_NUMBER: REF35180QDBVR; MOUSER_PART_NUMBER: 595-REF35180QDBVR; MOUSER_PRICE-STOCK: https://www.mouser.co.uk/ProductDetail/Texas-Instruments/REF35180QDBVR?qs=rQFj71Wb1eXMxDy8CoLU1Q%3D%3D
IC7 = SamacSys_Parts:SN74AUP1T58DRYR: SINGLE-SUPPLY VOLTAGE-LEVEL TRANSLATOR WITH NINE CONFIGURABLE GATE LOGIC FUNCTIONS Source: Datasheet <http://www.ti.com/lit/gpn/sn74aup1t58>; DESCRIPTION: SINGLE-SUPPLY VOLTAGE-LEVEL TRANSLATOR WITH NINE CONFIGURABLE GATE LOGIC FUNCTIONS; HEIGHT: mm; MANUFACTURER_NAME: Texas Instruments; MANUFACTURER_PART_NUMBER: SN74AUP1T58DRYR
J1-J3 J6 J7 = Eagle_WR-SMA (rev23a):60312202111527: WR-SMA PCB End Launch Characteristics Interface: MIL-STD-348 Mating Cycle: 500 Cycles Impedance: 50Ω Insulation Resistance: 5000MΩ(min.) Withstanding Voltage: 1000Vrms(min.) Ingress Protection: None l IP67 Mating: Screw (Recommended by torque wrench tool) Applications Network and communications RF Test and measurement equipment Industrial applications Electronic consumers and device Outdoor or humid environment <https://www.we-online.com/components/media/o122886v209%20Family-WR-SMA%20End%20Launch%20Connectors.jpg> Details see: www.we-online.com/components/products/COAX_SMA_CONNECTOR_PCB_END_LAUNCH <www.we-online.com/catalog/COAX_SMA_CONNECTOR_PCB_END_LAUNCH/?utm_source=eagle_model&utm_medium=description_link&utm_campaign=eisos_eagle> Updated by Ella Wu 2023-10-10 2023(C) Würth Elektronik; DATASHEET-URL: https://www.we-online.com/redexpert/spec/60312202111527?ae; FREQUENCY-RANGE: DC~18 GHz; IMPEDANCE: 50Ohm; INTERFACE: MIL-STD-348; MOUNT: End Launch; PART-NUMBER: 60312202111527; SIZE: Straight Jack
J8 J9 = Eagle_WR-BHD (rev22c):6250XX21621_62501021621: WR-BHD 2.00 mm Male Box Header KIND PROPERTIES: Pitch 2 mm Gender:Male MATERIAL PROPERTIES: Insulator Material:PBT Insulator Flammability Rating UL94 V-0 Insulator Color:Black Contact Material :Copper Alloy Contact Plating :Gold Contact Type: Stamped GENERAL INFORMATION: Operating Temperature:-40 °C up to +125 °C Compliance:RoHS Working Voltage: 250 V (AC) Withstanding Voltage:500 V (AC) Contact Resistance: 20 mΩ Insulation Resistance:1000 MΩ CERTIFICATION UL Approval:E323964 PACKAGING PROPERTIES Packaging :Tray <https://www.we-online.de/catalog/media/o32924v209%20Family_WR-BHD_6250xx21621.jpg> Details see: https://www.we-online.de/katalog/en/em/BHD_2_00_MALE_BOX_HEADER_6250XX21621 Updated by Ella Wu 2021-03-12 2021 (C) Würth Elektronik; CONTACT-RESISTANCE: 20mOhm; DATASHEET-URL: https://www.we-online.com/redexpert/spec/62501021621?ae; GENDER: Male; IR: 2A; LENGTH: 17.2mm; MOUNT: THT; PACKAGING: Tray; PART-NUMBER: 62501021621; PINS: 10; PITCH: 2mm; TYPE: Straight; WORKING-VOLTAGE: 250V(AC)
JP1 = SparkFun-Jumpers:JUMPER-SMT_3_1-NC_TRACE: Normally closed trace jumper (1 of 2 connections) This jumper has a trace between two pads so it's normally closed (NC). The other connection is normally open (NO). Use a razor knife to open the connection. For best results follow the IPC guidelines for cutting traces: Cutout at least 0.063 mm (0.005 in). Remove all loose material to clean up the cut area. Seal the cut with an approved epoxy. Reapply solder to reclose the connection, or to close the NO connection.
L1-L3 = EagleLibrary_Wuerth_Elektronik_eiSos_rev16a:WE-CBA: WE-CBA SMD EMI Suppression Ferrite Bead Characteristics Reliable Ni-Sn electrodes High rated current up to 5A Recommended soldering: Reflow Operating temperature: -55°C to +125°C Applications * Perfect as data line filter and for uncoupling of distribution voltage *This special SMD chip bead ferrites can be put directly on the printed circuit board. They offer excellent anti-EMI properties and low DC-resistance. Placed very close next to the interference source even with smallest size 0402,maximal impedance at 1000 Ω can be reached. *High Speed: "High Speed " SMD ferrites WE-CBF have lower impedance in the lower frequency ranges thus they have only a low attenuation for fast signals. Application e.g. USB 2.0, IEEE 1394,LVDS *Wide Band: "Wide Band" SMD ferrites WE-CBF already show high impedance in low frequency range. Therefore they are wide band through the whole spectrum. Application e.g. control signats, RS232, RS422, DC/DC converter *High Current: "High Current " SMD ferrites WE-CBF are designed for high current (over 1 A). The rated current refers to 40K self-heating. High current SMD ferrites are available in all there types (High Speed, Wide Band and High Frequency). Application e.g. power supply, DC/DC converter *Advice: Pay attention for the use of SMD-Ferrites for high current>1A and ambient temperature over +85°C that the rated current has to be reduced when temperature is above +85°C (Derating). *At+100°C environment temperature the maximal rated current has to add up to only 60% of the data sheet value ,without an overload of the component. Variant abbreviation WB means WIDE BAND HS means HIGH SPEED HC means HIGH CURRENT <http://katalog.we-online.de/media/images/eisos/FeCBA_pf2.jpg> Details see: http://katalog.we-online.de/en/pbs/WE-CBA/ Created: 2015-02-02 2015 (C) Wurth Elektronik
LED1 = led:LED: LED OSRAM: - CHIPLED LG R971, LG N971, LY N971, LG Q971, LY Q971, LO R971, LY R971 LH N974, LH R974 LS Q976, LO Q976, LY Q976 LO Q996 - Hyper CHIPLED LW Q18S LB Q993, LB Q99A, LB R99A - SideLED LS A670, LO A670, LY A670, LG A670, LP A670 LB A673, LV A673, LT A673, LW A673 LH A674 LY A675 LS A676, LA A676, LO A676, LY A676, LW A676 LS A679, LY A679, LG A679 - Hyper Micro SIDELED® LS Y876, LA Y876, LO Y876, LY Y876 LT Y87S - SmartLED LW L88C, LW L88S LB L89C, LB L89S, LG L890 LS L89K, LO L89K, LY L89K LS L896, LA L896, LO L896, LY L896 - TOPLED LS T670, LO T670, LY T670, LG T670, LP T670 LSG T670, LSP T670, LSY T670, LOP T670, LYG T670 LG T671, LOG T671, LSG T671 LB T673, LV T673, LT T673, LW T673 LH T674 LS T676, LA T676, LO T676, LY T676, LB T676, LH T676, LSB T676, LW T676 LB T67C, LV T67C, LT T67C, LS T67K, LO T67K, LY T67K, LW E67C LS E67B, LA E67B, LO E67B, LY E67B, LB E67C, LV E67C, LT E67C LW T67C LS T679, LY T679, LG T679 LS T770, LO T770, LY T770, LG T770, LP T770 LB T773, LV T773, LT T773, LW T773 LH T774 LS E675, LA E675, LY E675, LS T675 LS T776, LA T776, LO T776, LY T776, LB T776 LHGB T686 LT T68C, LB T68C - Hyper Mini TOPLED® LB M676 - Mini TOPLED Santana® LG M470 LS M47K, LO M47K, LY M47K Source: http://www.osram.convergy.de LUXEON: - LUMILED® LXK2-PW12-R00, LXK2-PW12-S00, LXK2-PW14-U00, LXK2-PW14-V00 LXK2-PM12-R00, LXK2-PM12-S00, LXK2-PM14-U00 LXK2-PE12-Q00, LXK2-PE12-R00, LXK2-PE12-S00, LXK2-PE14-T00, LXK2-PE14-U00 LXK2-PB12-K00, LXK2-PB12-L00, LXK2-PB12-M00, LXK2-PB14-N00, LXK2-PB14-P00, LXK2-PB14-Q00 LXK2-PR12-L00, LXK2-PR12-M00, LXK2-PR14-Q00, LXK2-PR14-R00 LXK2-PD12-Q00, LXK2-PD12-R00, LXK2-PD12-S00 LXK2-PH12-R00, LXK2-PH12-S00 LXK2-PL12-P00, LXK2-PL12-Q00, LXK2-PL12-R00 Source: www.luxeon.com KINGBRIGHT: KA-3528ASYC Source: www.kingbright.com
Q8 = Simplex-DiscreteSemi:MOSFET-NCHANNEL: Generic N-channel mosfet
R1 R4-R8 R12-R21 R23 R24 = rcl:R-EU_: RESISTOR, European symbol
R2 = resistor-array:CAY16A-2002F4LF: Resistor Networks & Arrays 20K 1% CONVEX SQUARE 4X0603 Source: Datasheet <https://www.bourns.com/docs/product-datasheets/cay16a-lf.pdf?sfvrsn=fc8c48f6_4>; DESCRIPTION: Resistor Networks & Arrays 20K 1% CONVEX SQUARE 4X0603; HEIGHT: 0.6mm; MANUFACTURER_NAME: Bourns; MANUFACTURER_PART_NUMBER: CAY16A-2002F4LF; MOUSER_PART_NUMBER: 652-CAY16A-2002F4LF; MOUSER_PRICE-STOCK: https://www.mouser.co.uk/ProductDetail/Bourns/CAY16A-2002F4LF?qs=DRkmTr78QARfyqk9aCUmrA%3D%3D
TP1-TP6 = testpad:TP: Test pad
U1 = SparkFun-IC-Microcontroller:ATMEGA328P_TQFP: Popular 328P in QFP Storefront component: ATmega328 - TQFP <https://www.sparkfun.com/products/13448> (COM-13448) Datasheet <http://www.sparkfun.com/datasheets/Components/SMD/ATMega328.pdf> SparkFun Products SparkFun RedBoard - Programmed with Arduino <https://www.sparkfun.com/products/12757> (DEV-12757) Arduino Pro Mini 328 - 5V/16MHz <https://www.sparkfun.com/products/11113> (DEV-11113) Arduino Pro Mini 328 - 3.3V/8MHz <https://www.sparkfun.com/products/11114> (DEV-11114) SparkFun OpenLog <https://www.sparkfun.com/products/13712> (DEV-13712) SparkFun MicroView - OLED Arduino Module <https://www.sparkfun.com/products/12923> (DEV-12923) SparkFun Digital Sandbox <https://www.sparkfun.com/products/12651> (DEV-12651) SparkFun PicoBoard <https://www.sparkfun.com/products/11888> (WIG-11888) Arduino Fio <https://www.sparkfun.com/products/10116> (DEV-10116) LilyPad Arduino 328 Main Board <https://www.sparkfun.com/products/13342> (DEV-13342) SparkFun RedStick <https://www.sparkfun.com/products/13741> (DEV-13741) LilyPad MP3 <https://www.sparkfun.com/products/11013> (DEV-11013) LilyPad Arduino SimpleSnap <https://www.sparkfun.com/products/10941> (DEV-10941) SparkFun Stepoko <https://www.sparkfun.com/products/13899> (ROB-13899) SparkFun Geiger Counter <https://www.sparkfun.com/products/11345> (SEN-11345) SparkFun EL Sequencer <https://www.sparkfun.com/products/12781> (COM-12781) Arduino Pro 328 - 5V/16MHz <https://www.sparkfun.com/products/10915> (DEV-10915) CryptoCape <https://www.sparkfun.com/products/12773> (DEV-12773) SparkFun IR Thermometer Evaluation Board - MLX90614 <https://www.sparkfun.com/products/10740> (SEN-10740) SparkFun RedBot Mainboard <https://www.sparkfun.com/products/12097> (ROB-12097) Arduino Pro 328 - 3.3V/8MHz <https://www.sparkfun.com/products/10914> (DEV-10914) SparkFun Block for Intel® Edison - Arduino <https://www.sparkfun.com/products/13036> (DEV-13036) SparkFun Simon Says - Surface Mount Soldering Kit <https://www.sparkfun.com/products/10935> (KIT-10935) SparkFun 7-Segment Serial Display - Red <https://www.sparkfun.com/products/11441> (COM-11441) SparkFun 7-Segment Serial Display - White <https://www.sparkfun.com/products/11629> (COM-11629) SparkFun 7-Segment Serial Display - Yellow <https://www.sparkfun.com/products/11443> (COM-11443) SparkFun 7-Segment Serial Display - Kelly Green <https://www.sparkfun.com/products/11440> (COM-11440) SparkFun 7-Segment Serial Display - Blue <https://www.sparkfun.com/products/11442> (COM-11442) SparkFun OpenSegment Serial Display - 20mm (Blue) <https://www.sparkfun.com/products/11647> (COM-11647) SparkFun OpenSegment Serial Display - 20mm (Green) <https://www.sparkfun.com/products/11646> (COM-11646) SparkFun OpenSegment Serial Display - 20mm (White) <https://www.sparkfun.com/products/11648> (COM-11648) SparkFun OpenSegment Serial Display - 20mm (Red) <https://www.sparkfun.com/products/11644> (COM-11644) SparkFun OpenSegment Serial Display - 20mm (Yellow) <https://www.sparkfun.com/products/11645> (COM-11645) SparkFun OpenSegment Shield <https://www.sparkfun.com/products/13190> (DEV-13190); PROD_ID: IC-09069
U$1 = laird-shield:BMI-S-209-F-20-R
Y1 = crystal:ABM8-12.000MHZ-12-B1U-T: CERAMIC SMD CRYSTAL Source: Datasheet <https://abracon.com/Resonators/abm8.pdf>; DESCRIPTION: CERAMIC SMD CRYSTAL; HEIGHT: 0.8mm; MANUFACTURER_NAME: ABRACON; MANUFACTURER_PART_NUMBER: ABM8-12.000MHZ-12-B1U-T; MOUSER_PART_NUMBER: 815-M812000MHZ12B1UT; MOUSER_PRICE-STOCK: https://www.mouser.co.uk/ProductDetail/ABRACON/ABM8-12.000MHZ-12-B1U-T?qs=vLWxofP3U2wqlTvBlimfnA%3D%3D

## Board
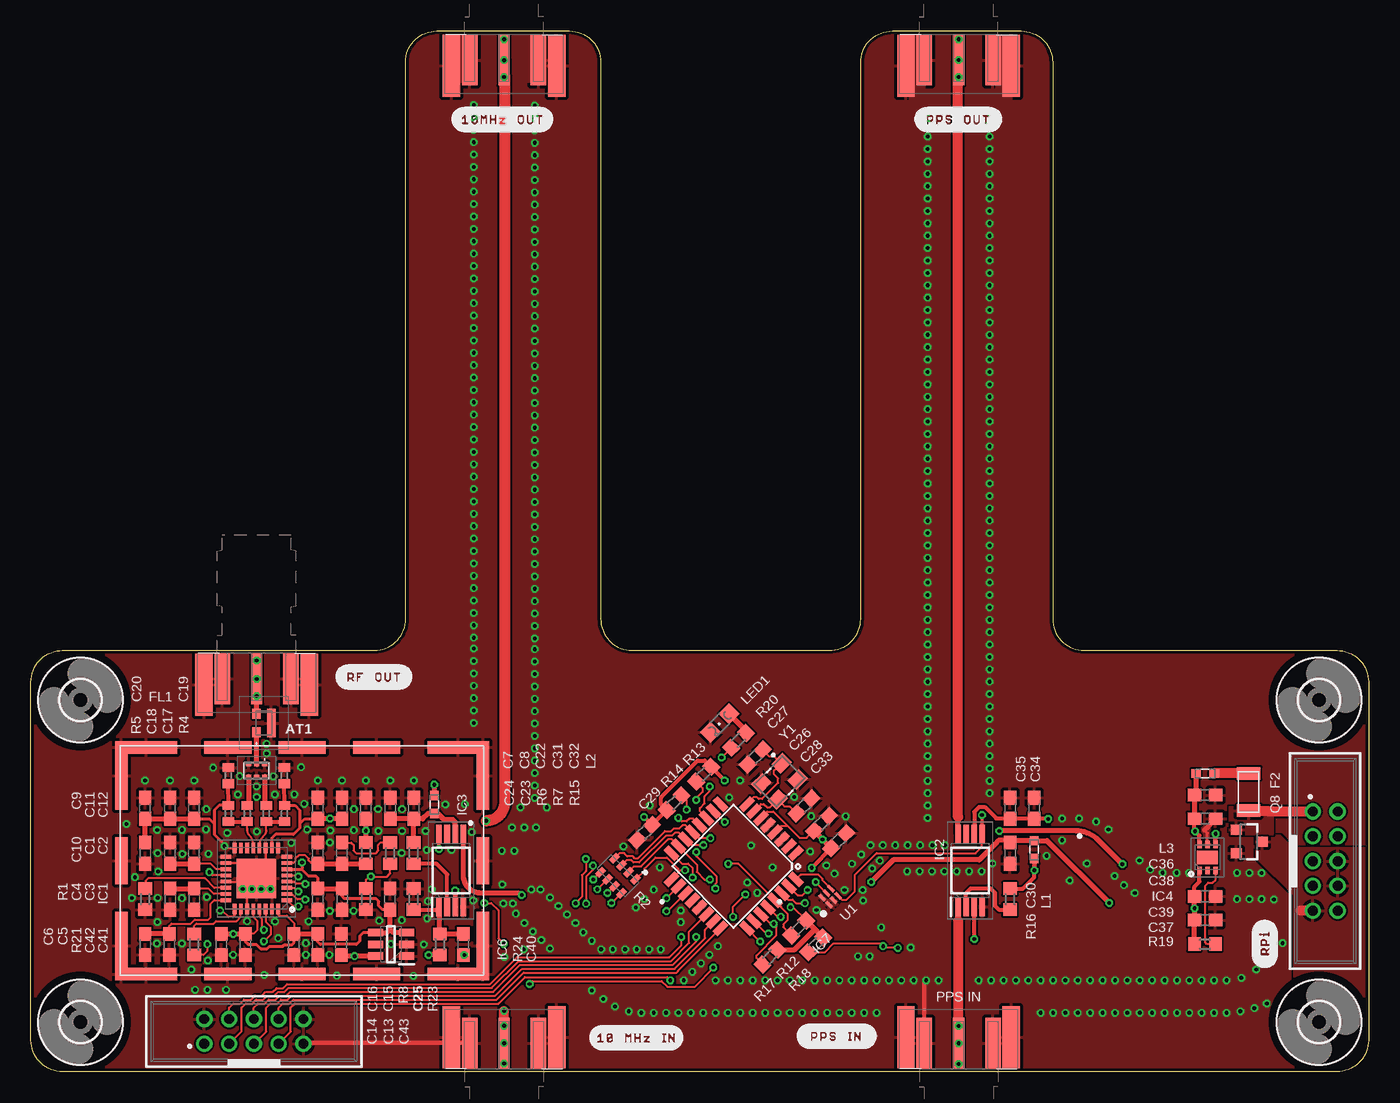
[diagram p7: board, top side]
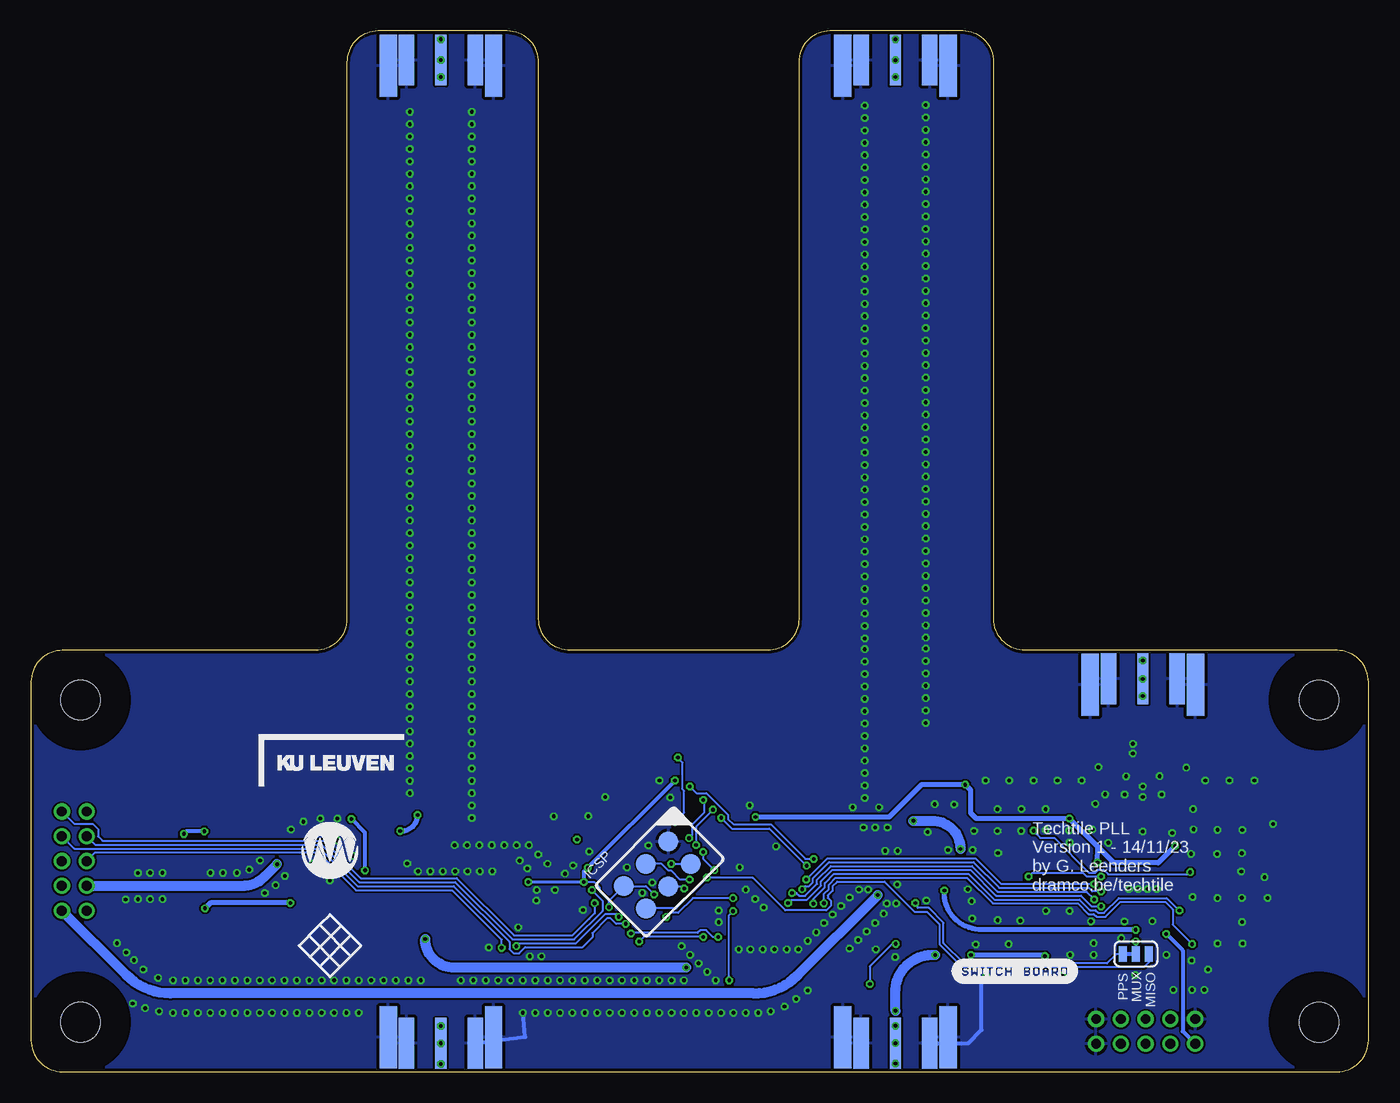
[diagram p8: board, bottom side, seen from below]

Size 108 x 84 mm. Coordinates in mm from the lower left corner, seen from the top.
Outline: 30.25,81.5 arc-90 32.75,84 43.5,84 arc-90 46,81.5 46,36.54 arc90 48.54,34 64.46,34 arc90 67,36.54 67,81.46 arc-90 69.54,84 79.96,84 arc-90 82.5,81.46 82.5,36.54 arc90 85.04,34 105.46,34 arc-90 108,31.46 108,2.54 arc-90 105.46,0 2.54,0 arc-90 0,2.54 0,31.46 arc-90 2.54,34 27.71,34 arc90 30.25,36.54 30.25,81.5
Copper layers (1*16): Top 0.035mm / dielectric 1.5mm / Bottom 0.035mm
Design rules "SeeedStudio_2layer_DRU_no_angle_20140221": minimum track width 6mil, minimum drill 12mil, track to track 6mil, track to pad 6mil, pad to pad 6mil, via to via 6mil, smd to smd 0mil, copper to edge 10mil, drill to drill 10mil, minimum pad ring 10mil, minimum via ring 6mil, stop-mask expansion 2mil, vias tented up to drill 100mil, thermal gap 10mil

### Footprints (pad centres in the part's own frame; a part is rotated, then mirrored left to right if it is on the bottom)
PAT1220C10DBT5 = smd 0.8 x 0.7: 1 -0.75,0.6; 2 0.75,0.6 | smd 2.3 x 0.7: 3 0,-0.6
C0603 = smd 1.1 x 1: 1 -0.85,0; 2 0.85,0
C0402 = smd 0.7 x 0.9: 1 -0.65,0; 2 0.65,0
1206 = smd 1 x 1.9: P$1 -1.5,0; P$2 1.5,0
B0430J50100AHF = smd 0.41 x 0.33: 1 -0.66,-0.495; 2 0,-0.495; 3 0.66,-0.495; 4 0.66,0.495; 5 0,0.495; 6 -0.66,0.495
3,2 = hole 3.2: 0,0
QFN50P500X500X80-33N = smd 0.85 x 0.3: 1 -2.45,1.75; 2 -2.45,1.25; 3 -2.45,0.75; 4 -2.45,0.25; 5 -2.45,-0.25; 6 -2.45,-0.75; 7 -2.45,-1.25; 8 -2.45,-1.75; 17 2.45,-1.75; 18 2.45,-1.25; 19 2.45,-0.75; 20 2.45,-0.25; 21 2.45,0.25; 22 2.45,0.75; 23 2.45,1.25; 24 2.45,1.75 | smd 0.3 x 0.85: 9 -1.75,-2.45; 10 -1.25,-2.45; 11 -0.75,-2.45; 12 -0.25,-2.45; 13 0.25,-2.45; 14 0.75,-2.45; 15 1.25,-2.45; 16 1.75,-2.45; 25 1.75,2.45; 26 1.25,2.45; 27 0.75,2.45; 28 0.25,2.45; 29 -0.25,2.45; 30 -0.75,2.45; 31 -1.25,2.45; 32 -1.75,2.45 | smd 3.2 x 3.2: 33 0,0
SOP65P640X120-8N = smd 1.475 x 0.45: 1 -2.938,0.975; 2 -2.938,0.325; 3 -2.938,-0.325; 4 -2.938,-0.975; 5 2.938,-0.975; 6 2.938,-0.325; 7 2.938,0.325; 8 2.938,0.975
SON65P200X200X80-7N = smd 0.6 x 0.35: 1 -1.05,0.65; 2 -1.05,0; 3 -1.05,-0.65; 4 1.05,-0.65; 5 1.05,0; 6 1.05,0.65 | smd 1.1 x 1.7: 7 0,0
SOT95P280X145-6N = smd 1.2 x 0.6: 1 -1.25,0.95; 2 -1.25,0; 3 -1.25,-0.95; 4 1.25,-0.95; 5 1.25,0; 6 1.25,0.95
SON50P100X145X60-6N = smd 0.66 x 0.254: 1 -0.406,0.508; 2 -0.406,0; 3 -0.406,-0.508; 4 0.406,-0.508; 5 0.406,0; 6 0.406,0.508
60312202111527 = smd 0.9 x 4.1: 1 0,0 | smd 1.25 x 4.1: 2 -2.775,0; 3 2.775,0 | smd 1.25 x 4.1 bottom: 4 -2.775,0; 5 2.775,0 | smd 0.9 x 4.1 bottom: 6 0,0 | smd 1.4 x 5: 7 -4.25,0.468; 8 4.25,0.468 | smd 1.4 x 5 bottom: 9 -4.25,0.468; 10 4.25,0.468
62501021621 = drill 0.8: 1 -4,-1; 2 -4,1; 3 -2,-1; 4 -2,1; 5 0,-1; 6 0,1; 7 2,-1; 8 2,1; 9 4,-1; 10 4,1
SMT-JUMPER_3_1-NC_TRACE_SILK = smd 0.66 x 1.27: 1 -1.041,0; 2 0,0; 3 1.041,0
WE-CBA_0603(W=2.2) = smd 0.75 x 0.7: 1 -0.725,0; 2 0.725,0
CHIPLED_0805 = smd 1.2 x 1.2: A 0,-1.05; C 0,1.05
SOT23-3 = smd 0.8 x 0.9: 1 -0.95,-1; 2 0.95,-1; 3 0,1.1
R0603 = smd 1 x 1.1: 1 -0.85,0; 2 0.85,0
CAY16A1003F4LF = smd 0.45 x 0.8: 1 -1.2,-0.8; 2 -0.4,-0.8; 3 0.4,-0.8; 4 1.2,-0.8; 5 1.2,0.8; 6 0.4,0.8; 7 -0.4,0.8; 8 -1.2,0.8
R0402 = smd 0.7 x 0.9: 1 -0.65,0; 2 0.65,0
TP16R = smd 1.6 x 1.6: TP 0,0
TQFP32-08 = smd 1.27 x 0.559: 1 -4.293,2.8; 2 -4.293,2; 3 -4.293,1.2; 4 -4.293,0.4; 5 -4.293,-0.4; 6 -4.293,-1.2; 7 -4.293,-2; 8 -4.293,-2.8; 17 4.293,-2.8; 18 4.293,-2; 19 4.293,-1.2; 20 4.293,-0.4; 21 4.293,0.4; 22 4.293,1.2; 23 4.293,2; 24 4.293,2.8 | smd 0.559 x 1.27: 9 -2.8,-4.293; 10 -2,-4.293; 11 -1.2,-4.293; 12 -0.4,-4.293; 13 0.4,-4.293; 14 1.2,-4.293; 15 2,-4.293; 16 2.8,-4.293; 25 2.8,4.293; 26 2,4.293; 27 1.2,4.293; 28 0.4,4.293; 29 -0.4,4.293; 30 -1.2,4.293; 31 -2,4.293; 32 -2.8,4.293
BMI-S-209-F-20-R = smd 1 x 4.98: P$1 0,6; P$4 18.3,6; P$9 0,-19.2; P$14 18.3,-19.2 | smd 5.55 x 1: P$2 2.275,8; P$5 16.025,8; P$10 2.275,-21.2; P$15 16.025,-21.2 | smd 3.8 x 1: P$3 9.15,8; P$16 9.15,-21.2 | smd 1 x 3.8: P$6 18.3,-0.6; P$7 18.3,-6.6; P$8 18.3,-12.6; P$11 0,-0.6; P$12 0,-6.6; P$13 0,-12.6
ABM810000MHZ12D2W = smd 1.3 x 1.05: 1 -1.15,-0.925; 2 1.15,-0.925; 3 1.15,0.925; 4 -1.15,0.925

### Placement (x,y rotation side)
AT1  18.81,28.14 90 top
C1  11.24,17.63 90 top
C2  13.18,17.63 90 top
C3  13.18,13.93 270 top
C4  11.24,13.93 270 top
C5  11.18,10.27 270 top
C6  9.22,10.27 270 top
C7  23.16,21.26 90 top
C8  25.12,21.26 90 top
C9  9.22,21.26 90 top
C10  9.22,17.63 270 top
C11  11.24,21.26 90 top
C12  13.18,21.26 90 top
C13  23.16,10.27 270 top
C14  21.23,10.27 270 top
C15  25.12,13.93 270 top
C16  23.16,13.93 270 top
C17  19.01,20.84 90 top
C18  17.46,20.84 90 top
C19  20.46,23.89 270 top
C20  15.94,23.89 270 top
C22  27.05,21.26 90 top
C23  25.12,17.63 90 top
C24  23.16,17.63 90 top
C25  29,13.93 90 top
C26  62.42,21.45 225 top
C27  58.48,25.4 45 top
C28  63.83,20.05 225 top
C29  49.54,19.31 45 top
C30  79.05,17.63 270 top
C31  29.01,21.26 90 top
C32  30.92,21.26 90 top
C33  65.21,18.65 45 top
C34  81,21.26 90 top
C35  79.05,21.26 90 top
C36  94.8,22.32 0 top
C37  94.8,12.23 0 top
C38  94.8,20.41 0 top
C39  94.8,14.16 0 top
C40  34.91,10.27 90 top
C41  17.3,10.27 270 top
C42  15.38,10.27 270 top
C43  25.05,10.27 90 top
F2  98.32,22.58 90 top
FL1  18.23,24.3 180 top
H1  4,30 0 top
H2  4,4 0 top
H3  104,30 0 top
H4  104,4 0 top
IC1  18.2,15.59 180 top
IC2  75.83,16.24 90 top
IC3  33.92,16.24 90 top
IC4  95,17.3 90 top
IC6  29.07,10.27 180 top
IC7  64.52,14.13 135 top
J1  74.9,81.65 180 top
J2  38.2,81.65 180 top
J3  18.23,31.71 180 top
J6  74.9,2.3 0 top
J7  38.2,2.3 0 top
J8  104.5,17 270 top
J9  18,3.25 0 top
JP1  18.79,9.5 180 bottom
L1  81,17.92 270 top
L2  32.57,21.56 270 top
L3  94.8,24.07 180 top
LED1  55.63,28.14 135 top
Q8  98.31,18.56 270 top
R1  9.22,13.93 270 top
R2  47.41,15.83 135 top
R4  20.47,20.84 270 top
R5  15.95,20.84 270 top
R6  27.05,17.63 270 top
R7  29,17.63 90 top
R8  27.05,13.93 90 top
R12  62,11.6 45 top
R13  54.31,24.01 45 top
R14  51.93,21.71 225 top
R15  30.9,17.63 90 top
R16  79.05,13.93 90 top
R17  59.67,9.24 45 top
R18  63.35,10.24 45 top
R19  94.79,10.29 180 top
R20  57.13,26.75 225 top
R21  13.18,10.27 90 top
R23  30.9,13.93 270 top
R24  33.02,10.27 270 top
TP1  58.34,13.18 45 bottom
TP2  56.55,14.96 45 bottom
TP3  54.74,16.78 45 bottom
TP4  60.14,14.98 45 bottom
TP5  58.35,16.77 45 bottom
TP6  56.54,18.58 45 bottom
U1  56.74,16.58 225 top
U$1  15.3,7.88 90 top
Y1  60.44,23.43 225 top

### Tracks (layer width: path | path; a pad name or v marks a point on that pad's centre or on a via)
5VIN
  Top 0.813: F2.P$1 98.12,21.08 98.36,21.01 99.99,21.01 99.97,21 J8.1
  pour Top: 96.75,21.34 96.75,19.17 100.3,19.17 100.3,21.34
10MHZ_IN  (via drill 0.3)
  Top 0.305: v38.2,0.65 J7.6
  Top 0.813: J7.6 v38.2,3.7 v38.2,4.91 | v34.99,9.43 C40.1
  Bottom 0.813: v38.2,4.91 38.2,6.64 arc90 v34.99,9.43
  other vias: 38.2,2.3
10MHZ_PLL  (via drill 0.3)
  Top 0.152: IC1.29 18.45,12.52 18.62,12.35 18.62,11.62 v18.8,11.45
  Top 0.406: v34.25,14.62 IC3.3
  Bottom 0.406: v18.8,11.45 31.48,11.48 arc90 v34.25,14.62
10MHZ_RPI  (via drill 0.3)
  Top 0.406: IC3.5 34.9,15.85 arc90 36.31,14.44 39.17,14.44 arc-45 v39.62,14.25
  Bottom 0.813: J8.10 100.28,7.78 arc-45 96.74,6.31 49.63,6.31 arc-45 46.1,7.78 v39.62,14.25
10MHZ_USRP  (via drill 0.3)
  Top 0.305: v32.95,17.98 IC3.8 | v38.2,83.33 J2.6 v38.2,81.64
  Top 0.813: J2.6 arc-90 38.25,81.6 38.25,80.33
  Top 0.892: 38.25,80.33 38.25,21.75 arc-90 v36.75,20.25
  Bottom 0.305: v38.2,81.64 v38.2,80.28 | J2.6 v38.2,83.33
  Bottom 0.813: v36.75,20.25 35.23,20.25 arc90 v32.95,17.98
+3V3  (via drill 0.3)
  Top 0.152: U1.6 59.44,20.99 59.95,20.99 61.09,19.84 | 61.09,19.84 62.07,18.87 62.63,18.87 63.21,19.45 C28.2 | U1.4 60.56,19.84 61.09,19.84 | R12.2 61.52,13.28 v61.33,13.28 | 52.29,14.92 U1.18 52.28,14.96 v51.31,14 | C41.1 17.33,11.15 18,11.15 18.25,11.4 18.25,12.2 17.95,12.5 IC1.28 | C14.1 21.25,11.14 21.25,12 20.65,12.6 20.02,12.6 19.95,12.67 IC1.32 | IC1.16 15.78,18.05 v15.62,18.2 | IC1.6 21.84,16.34 21.88,16.38 | v63.36,15.31 63.36,15.29 IC7.5 | v56.69,12.5 56.69,13.31 v57.69,14.31
  Top 0.254: R5.1 15.19,21.48 14.8,21.1 14.8,20 | 14.8,20 14.8,19.15 15.4,18.55 | C12.1 14.39,20.41 14.8,20 | R4.1 21.32,21.48 21.7,21.1 21.7,20 | 21.7,20 21.7,19.65 21.2,19.15 19.75,19.15 19.45,18.85 IC1.10 | 21.7,20 22.1,20.4 C7.1 | IC1.6 21.86,16.34 22.4,15.8 23,15.8 23.15,15.65 23.15,14.78 C16.1 | C25.1 28.38,13.07 28.07,13.38 28.07,13.75 27.85,13.98 25.3,13.98 25.12,14.15 C15.1 | v21.89,16.89 21.89,16.39 21.88,16.38 | IC6.4 26.82,11.23 26.54,10.94 26.54,10.54 26.27,10.27 23.35,10.27 23.15,10.48 C13.1 | C41.1 17.3,10.5 17.52,10.27 18.2,10.27 18.55,9.93 19.07,9.93 19.26,10.11 20.34,10.11 20.49,10.26 21.1,10.26 21.25,10.41 21.25,11.11 C14.1
  Top 0.305: C39.1 93.94,14.95 94.35,15.35 IC4.1 | R5.1 C20.2 | R4.1 C19.2 | v56,23.5 56,23.52 R13.2 54.4,25.11 53.83,25.11 50.88,22.16 50.89,22.15 50.89,21.56 51.33,21.12 R14.2 50.14,19.92 C29.2 v49.5,20.56 | C33.1 64.61,18.02 v63.04,16.46 | v16.34,11.12 16.55,11.12
  Top 0.406: C39.1 v93.94,13.19 C37.1 93.94,12.23 R19.2 | C28.2 v63.91,18.75 C33.1 | C10.1 C9.1 C11.1 C12.1 | C42.1 15.3,11.12 v16.34,11.12 16.55,11.12 C41.1 | C14.1 C13.1 | C16.1 C15.1 | C7.1 C8.1 24.16,20.41 v24.15,20.42 | IC6.3 29.27,11.23 29,11.5 | 29,11.5 C25.1 | IC6.4 28.73,11.23 29,11.5 | v32.56,23.16 L2.1 | R12.2 63.3,11.49 | 63.3,11.49 R18.2 | v87.06,13.62 82.04,18.65 L1.1 79.05,18.65 C30.1 79.05,18.62 79.01,18.66 78.12,18.66 77.81,18.35 77.81,18.34 76.56,17.09 69.62,17.09 v67.85,15.31 | R17.2 61.66,9.84 63.3,11.49
  Bottom 0.152: v61.33,13.28 61.33,13.81 | 61.33,13.81 60.16,14.98 TP4.TP 58.35,14.98 v57.69,14.31 | v63.36,15.31 62.52,15.31 62.09,14.88 62.09,14.57 61.33,13.81 | v51.31,14 54.56,14 55.75,12.81 56.38,12.81 v56.69,12.5
  Bottom 0.254: 65.89,15.31 65.5,15.31 | 65.5,15.31 v63.36,15.31 | v67.85,15.31 65.5,15.31
  Bottom 0.305: v63.36,15.31 63.36,16.14 v63.04,16.46 v56,23.5 | J9.1 15,3.25 15,9.78 v16.34,11.12
  Bottom 0.406: v15.62,18.2 16.98,16.85 20.57,16.85 21.88,18.15 | 21.88,18.15 v24.15,20.42 31.68,20.42 32.12,20.88 32.12,22.73 v32.56,23.16 32.59,23.19 36.06,23.19 38.69,20.56 v49.5,20.56 | v21.89,16.89 21.88,18.15 | v87.06,13.62 93.51,13.62 v93.94,13.19
  pour Top: 15.25,17.2 15.25,18.6 16.6,18.6 16.6,17.2
+5V
  Top 0.813: F2.P$2 L3.1
A0
  Top 0.152: J9.5 18.01,2.25 19,3.24 19,5.18 19.32,5.5 19.89,5.5 20.2,5.81 20.74,5.81 21.05,6.12 37.46,6.12 39.64,8.3 51.96,8.3 54.44,10.77 54.44,11.45 U1.23
A1
  Top 0.152: J9.8 20,5.18 20.32,5.5 20.86,5.5 21.18,5.81 37.6,5.81 39.77,7.99 52.12,7.99 52.26,8.12 52.26,8.15 U1.24
A2  (via drill 0.3)
  Top 0.152: J9.6 18,5.18 18.32,5.5 18.89,5.5 19.2,5.81 19.76,5.81 20.07,6.12 20.61,6.12 20.93,6.44 37.33,6.44 39.5,8.61 51.83,8.61 53.71,10.5 v53.71,10.88 | v58.89,10.5 58.86,10.5 U1.25
  Bottom 0.152: v53.71,10.88 58.51,10.88 v58.89,10.5
A3  (via drill 0.3)
  Top 0.152: J9.4 16,5.16 16.34,5.5 16.9,5.5 17.21,5.81 17.76,5.81 18.09,6.14 18.65,6.14 18.95,6.44 19.51,6.44 19.82,6.75 20.35,6.75 20.68,7.07 37.08,7.07 39.24,9.24 51.55,9.24 52.51,10.2 v52.51,10.86 | v59.55,11.16 59.33,11.16 U1.26
  Bottom 0.152: v52.51,10.86 52.92,10.86 53.49,11.43 53.95,11.43 54.16,11.21 59.5,11.21 v59.55,11.16
A6  (via drill 0.3)
  Top 0.152: J9.7 20.01,2.25 20.99,3.23 20.99,5.19 21.3,5.5 37.75,5.5 39.88,7.62 51.38,7.62 v51.62,7.38 | v51.31,12.95 51.41,12.95 U1.19
  Bottom 0.152: v51.62,7.38 51.62,12.64 v51.31,12.95
A7
  Top 0.152: J9.3 17,3.25 17,5.16 17.34,5.5 17.89,5.5 18.2,5.81 18.76,5.81 19.07,6.12 19.64,6.12 19.95,6.44 20.48,6.44 20.8,6.76 37.2,6.76 39.36,8.93 51.69,8.93 53.15,10.39 53.15,11.3 U1.22
CE  (via drill 0.3)
  Top 0.152: R2.4 | R13.1 54.23,22.9 54.23,22.59 53.71,22.08 v53.71,21.94 | v54.86,18.85 54.88,18.84 53.91,18.84 U1.13 52.86,19.89 52.61,19.89 52.36,19.64 51.91,19.64 51.69,19.41 51.19,19.41 48.98,17.2 48.79,17.2 48.6,17.39 48.14,17.39 47.89,17.64 47.53,17.64 R2.4
  Bottom 0.152: v54.86,18.85 54.89,18.84 54.62,19.1 54.62,19.92 53.66,20.89 53.66,21.89 v53.71,21.94
CLK  (via drill 0.3)
  Top 0.152: R2.1 49.52,16.24 49.52,16.39 50.42,17.29 51.35,17.29 52.25,16.39 52.25,16.05 | 52.25,16.05 U1.17 | v55.26,14.79 55.26,15.16 55.38,15.27 55.38,15.73 53.73,17.38 v53.73,17.73 | v52.81,16.26 52.46,16.26 52.25,16.05
  Bottom 0.152: TP2.TP 55.44,14.97 v55.26,14.79 | v53.73,17.73 53.73,17.17 v52.81,16.26
CP
  Top 0.152: C24.1 23.1,16.84 22.61,16.84 22.43,17.02 22.43,17.19 22.12,17.49 21.65,17.49 21.35,17.19 21.35,17 21.2,16.85 IC1.7
  Top 0.406: C24.1 C23.1 R6.2
D0  (via drill 0.3)
  Top 0.152: U1.30 61.14,13.88 61.5,13.88 61.78,13.6 v62.49,13.6
  Bottom 0.152: v62.49,13.6 62.49,12.78 62.93,12.34 64.28,11 69,11 73.62,15.62 81.38,15.62 84.39,18.64 102.22,18.64 102.58,19 102.58,19.59 103,20 104.5,20 J8.2
D1  (via drill 0.3)
  Top 0.152: U1.31 61.9,14.25 62.3,14.25 v62.7,14.66
  Bottom 0.152: v62.7,14.66 61.85,13.81 61.85,12.96 64.14,10.68 69.12,10.68 73.75,15.3 81.5,15.3 84.53,18.33 102.83,18.33 J8.3
D2
  Top 0.152: U1.32 61.77,15.53 62.14,15.9 63.59,15.9 63.92,15.56 63.92,15.44 IC7.4
D6  (via drill 0.3)
  Top 0.152: U1.10 55.14,21.03 v56.01,20.16 | R20.2 56.53,26.12 v55.76,25.35
  Bottom 0.152: v56.01,20.16 55.26,20.91 55.26,22.67 55.38,22.79 55.38,24.95 55.71,25.29 v55.76,25.35
GND  (via drill 0.3)
  Top 0.152: IC1.21 17.95,15.34 IC1.33 | IC1.18 16.95,16.84 IC1.33 | IC1.27 17.45,14.84 IC1.33 | IC1.11 18.95,16.45 18.75,16.25 18.75,16.14 IC1.33
  Top 0.254: IC4.5 95,19.26 94.75,19.5
  Top 0.305: J6.2 72.12,7.22 v72.28,7.38 | J7.2 21.93,2.3 21.88,2.25 J9.9 22.12,2.38 35.35,2.38 J7.2
  Top 0.406: C38.2 95.64,20.4 94.75,19.5
  Bottom 0.305: J6.2 68.1,2.8 v68.28,4.75 | J7.2 32.33,2.3 31.25,3.38 31.25,7.38 v30.88,7.75
  other vias: 58.14,18.26 59.88,16.5 97.38,13.93 98.38,13.93 77.4,48.47 77.4,49.47 77.4,50.47 77.4,51.47 77.4,52.47 77.4,53.47 77.4,54.47 77.4,55.47 77.4,56.47 77.4,57.47 77.4,58.47 77.4,59.47 77.4,60.47 77.4,61.47 77.4,62.47 77.4,63.47 77.4,64.47 77.4,65.47 77.4,66.47 77.4,67.47 77.4,68.47 77.4,69.47 77.4,70.47 77.4,71.47 77.4,72.47 77.4,73.47 77.4,74.47 77.4,75.47 77.4,76.47 77.4,77.47 40.67,46.97 40.67,47.97 40.67,48.97 40.67,49.97 40.67,50.97 40.67,51.97 40.67,52.97 40.67,53.97 40.67,54.97 40.67,55.97 40.67,56.97 40.67,57.97 40.67,58.97 40.67,59.97 40.67,60.97 40.67,61.97 40.67,62.97 40.67,63.97 40.67,64.97 40.67,65.97 40.67,66.97 40.67,67.97 40.67,68.97 40.67,69.97 40.67,70.97 40.67,71.97 40.67,72.97 40.67,73.97 40.67,74.97 40.67,75.97 40.67,34.98 40.67,35.98 40.67,36.98 40.67,37.98 40.67,38.98 40.67,39.98 40.67,40.98 40.67,41.98 40.67,42.98 40.67,43.98 40.67,44.98 40.67,45.98 77.4,36.48 77.4,37.48 77.4,38.48 77.4,39.48 77.4,40.48 77.4,41.48 77.4,42.48 77.4,43.48 77.4,44.48 77.4,45.48 77.4,46.48 77.4,47.47 35.75,47.03 35.75,48.03 35.75,49.03 35.75,50.03 35.75,51.03 35.75,52.03 35.75,53.03 35.75,54.03 35.75,55.03 35.75,56.03 35.75,57.03 35.75,58.03 35.75,59.03 35.75,60.03 35.75,61.03 35.75,62.03 35.75,63.03 35.75,64.03 35.75,65.03 35.75,66.03 35.75,67.03 35.75,68.03 35.75,69.03 35.75,70.03 35.75,71.03 35.75,72.03 35.75,73.03 35.75,74.03 35.75,75.03 35.75,76.03 35.75,35.02 35.75,36.02 35.75,37.02 35.75,38.02 35.75,39.02 35.75,40.02 35.75,41.02 35.75,42.02 35.75,43.02 35.75,44.02 35.75,45.02 35.75,46.02 72.4,48.47 72.4,49.47 72.4,50.47 72.4,51.47 72.4,52.47 72.4,53.47 72.4,54.47 72.4,55.47 72.4,56.47 72.4,57.47 72.4,58.47 72.4,59.47 72.4,60.47 72.4,61.47 72.4,62.47 72.4,63.47 72.4,64.47 72.4,65.47 72.4,66.47 72.4,67.47 72.4,68.47 72.4,69.47 72.4,70.47 72.4,71.47 72.4,72.47 72.4,73.47 72.4,74.47 72.4,75.47 72.4,76.47 72.4,77.47 72.4,35.48 72.4,36.48 72.4,37.48 72.4,38.48 72.4,39.48 72.4,40.48 72.4,41.48 72.4,42.48 72.4,43.48 72.4,44.48 72.4,45.48 72.4,46.48 72.4,47.47 64.88,15.98 68.65,11.65 63.43,13.05 97.38,16.05 98.38,16.05 18.23,23.02 18.23,22.17 17.45,12.15 24.14,12.98 26.05,12.99 32.35,14.73 35.7,13.82 24.18,19.48 21.01,18.48 24.14,18.5 28.05,19.44 28.02,21.21 26.07,21.19 26.06,19.49 22.3,19.54 22.06,21.62 19.96,10.77 22.2,9.44 22.19,10.38 16.32,9.44 14.2,14.1 12.2,14 12.22,17.58 10.22,17.64 14.34,17.59 15.85,19.27 18.24,19.39 16.71,22.38 19.7,22.38 16.86,23.85 19.57,23.84 19.04,25.69 19.02,26.46 14.71,24.54 21.81,24.58 10.19,19.51 12.2,19.52 14.14,19.56 12.2,10.35 10.18,10.35 10.21,12.07 10.22,14.04 10.28,16.16 8.4,15.7 19.71,12.12 22.41,12.14 28.11,12.19 29.94,12.23 32,12.38 31.96,17.9 29.93,17.65 29.96,19.42 31.86,19.44 29.96,21.19 33.46,21.56 24.7,7.75 29.06,10.29 31.71,10.27 8.15,14.02 14.29,8.98 12.96,8.24 18.84,7.81 17.09,14.74 17.84,14.74 18.59,14.74 19.34,14.74 57.25,23.5 56.38,22.12 63,20.62 61.64,22.16 62.92,17.76 65.79,20.61 64.22,16.65 67.72,9.31 66.78,9.31 71.03,10.02 99.36,13.93 100.35,13.9 99.36,16.04 68.54,17.03 67.92,16.41 67.17,14.66 67.19,13.81 69.79,18.28 70.79,18.28 71.79,18.28 72.79,18.28 73.79,18.28 68.79,18.28 67.79,18.28 67.04,17.53 66.29,16.78 65.69,14.67 35.02,21.59 39.52,21.34 38.84,19.71 41.65,21.34 39.84,19.71 40.77,19.71 52.72,7.37 50.84,9.87 49.9,9.87 48.9,9.87 47.97,9.87 46.97,9.87 53.4,8.06 54.09,8.75 54.78,9.44 55.47,10.12 46.03,9.87 45.28,10.56 44.59,11.25 43.97,12 43.28,12.69 42.59,13.37 41.9,14.06 39.84,12 39.15,12.75 40.53,11.31 41.22,10.62 41.9,9.94 45.28,6.56 46.22,5.87 47.15,5.25 48.28,4.87 50.78,16.5 50.28,14.69 47.84,18.19 49.53,13.94 48.84,13.25 49.97,21.5 24.09,9.44 38.05,15.11 38.15,13.57 38.02,17.83 39.02,17.83 38.22,9.25 39.78,9.87 40.4,14.7 41.14,14.7 38.9,13.57 52.47,13 52.47,12.06 58.64,14.44 57.84,15.26 32.05,13.76 89.12,14.43 88.25,15.05 87.5,15.8 89.5,17.05 90.38,16.3 91.38,16.05 92.5,16.05 93.5,16.05 85.25,16.8 83.88,15.42 82,17.42 83.25,18.67 83.25,20.42 87,19.55 86,20.17 84.62,20.42 77.62,16.8 76.75,16.17 75.75,16.17 74.75,16.17 73.75,16.17 72.75,16.17 71.75,16.17 70.75,16.17 40.67,24.1 40.67,25.1 40.67,26.1 40.67,27.1 40.67,28.1 40.67,29.1 40.67,30.1 40.67,31.1 40.67,32.1 40.67,33.1 40.67,34.1 40.67,22.1 40.67,23.1 35.75,28.15 35.75,29.15 35.75,30.15 35.75,31.15 35.75,32.15 35.75,33.15 35.75,34.15 77.4,35.48 49.28,4.75 50.28,4.75 51.28,4.75 52.28,4.75 53.28,4.75 54.28,4.75 55.28,4.75 56.28,4.75 57.28,4.75 58.28,4.75 59.28,4.75 60.28,4.75 61.28,4.75 62.28,4.75 63.28,4.75 64.28,4.75 65.28,4.75 66.28,4.75 67.28,4.75 55.28,7.37 56.28,7.37 57.28,7.37 58.28,7.37 59.28,7.37 60.28,7.37 61.28,7.37 62.28,7.37 63.28,7.37 64.28,7.37 65.28,7.37 66.28,7.37 67.28,7.37 68.28,7.37 69.28,7.37 70.28,7.37 71.28,7.37 73.28,7.37 23.16,23.5 76.53,7.37 77.53,7.37 78.53,7.37 79.53,7.37 80.53,7.37 81.53,7.37 82.53,7.37 83.53,7.37 84.53,7.37 85.53,7.37 86.53,7.37 87.53,7.37 88.53,7.37 89.53,7.37 90.53,7.37 91.53,7.37 92.53,7.37 93.53,7.37 94.53,7.37 95.53,7.37 96.53,7.37 97.73,7.57 98.93,8.25 99.68,9 100.3,9.62 101.05,10.37 81.53,4.75 82.53,4.75 83.53,4.75 84.53,4.75 85.53,4.75 86.53,4.75 87.53,4.75 88.53,4.75 89.53,4.75 90.53,4.75 91.53,4.75 92.53,4.75 93.53,4.75 94.53,4.75 95.53,4.75 96.53,4.75 97.65,4.87 98.78,5.12 99.78,5.5 25.12,23.5 27.05,23.5 29.01,23.5 30.92,23.5 13.18,23.5 11.24,23.5 9.22,23.5 7.72,20 14.16,21.19 21.27,22.39 33.96,17.9 35.59,19.34 15.76,6.61 14.26,6.61 13.26,6.61 77.4,34.48 77.4,22.48 77.4,23.48 77.4,24.48 77.4,25.48 77.4,26.48 77.4,27.48 77.4,28.48 77.4,29.48 77.4,30.48 77.4,31.48 77.4,32.48 77.4,33.48 72.4,34.48 72.4,21.48 72.4,22.48 72.4,23.48 72.4,24.48 72.4,25.48 72.4,26.48 72.4,27.48 72.4,28.48 72.4,29.48 72.4,30.48 72.4,31.48 72.4,32.48 72.4,33.48 72.4,20.48 35.75,77.03 40.67,76.97 40.67,77.97 35.75,78.03
  pour Top (rank 5): 0,85 0,0 108,-0.5 108.5,84.5
  pour Bottom: 108.5,85 108.5,0 0,0 -0.5,85.5
  pour Top (no thermals): 34,83.5 34,80 35,80 35,83.5
  pour Top (no thermals): 40,83.5 40,80 41,80 41,83.5
  pour Top (no thermals): 71,83.5 71,78.5 72,78.5 72,83.5
  pour Top (no thermals): 78,83.5 78,78.5 79,78.5 79,83.5
GNDIN
  Top 0.813: J8.9 102.5,13
  pour Top (rank 3): 108,18 101.88,18 100.88,19 98.92,19 98.95,17.3 102,14.3 102,0 108,0
LD  (via drill 0.3)
  Top 0.152: IC1.25 16.45,12.66 16.3,12.5 15.95,12.5 15.45,13 v15.28,13 | U1.12 53.46,20.42 53.16,20.42 52.94,20.2 52.56,20.2 v52.27,20.49 | v45.38,16.62 45.38,16.3 44.83,15.75 v44.83,13.56
  Bottom 0.152: v52.27,20.49 51.41,19.62 48.38,19.62 v45.38,16.62 | v44.83,13.56 44.83,13.95 43.9,14.88 43.9,15.23 43.15,15.98 32.3,15.98 30.21,13.89 23.34,13.89 22.49,13.04 22.05,13.04 21.82,12.81 21.36,12.81 20.16,14.01 16.29,14.01 v15.28,13
LE  (via drill 0.3)
  Top 0.152: R2.3 48.08,17.06 48.48,17.06 48.65,16.89 49.11,16.89 51.3,19.08 51.79,19.08 52.04,19.33 52.3,19.33 U1.14 53.34,18.29 v54.3,18.29 | R14.1 52.94,21.9 v52.94,21.15
  Bottom 0.152: v52.94,21.15 54.3,19.77 v54.3,18.29
MISO  (via drill 0.3)
  Top 0.152: v53.42,15.66 53.42,16.44 53.07,16.8 52.57,16.8 U1.16
  Bottom 0.152: TP1.TP 55.91,13.18 v53.42,15.66 53.41,15.65 49.71,15.65 47.09,13.02 43.77,13.02 43.42,13.38 43.42,13.81 43.65,14.04 43.65,14.23 43.27,14.6 43.27,14.95 42.89,15.34 39.09,15.34 36.62,12.88 35.62,12.88 34.62,11.88 34.62,10.25 32.81,8.44 18.12,8.44 17.74,8.82 JP1.1
MOSI  (via drill 0.3)
  Top 0.152: 53.78,16.72 53.78,16.12 54.39,15.51 v54.82,15.51 | R2.2 48.71,16.56 49.26,16.56 51.45,18.75 51.75,18.75 51.87,18.63 51.87,18.62 U1.15 53.78,16.72 | 53.78,16.72
  Bottom 0.152: v54.82,15.51 55.6,15.51 56.29,16.23 56.53,16.23 57.07,16.77 TP5.TP
MUX_OUT  (via drill 0.3)
  Top 0.152: IC1.30 18.95,12.09 19.35,11.7 19.35,11.05 18.95,10.65 v18.8,10.52
  Bottom 0.152: 18.95,9.56 JP1.2 v18.8,10.52
N$1
  Top 0.152: IC1.24 14.8,13.85 14.5,13.55 14.5,12.45 14.32,12.27 13.22,12.27 12.9,11.95 11.35,11.95 11.18,11.78 C5.1 11.15,11.16
  Top 0.406: C5.1 C6.1
N$2
  Top 0.152: IC1.22 14.8,14.84 14.05,15.6 9.45,15.6 9.25,15.4 9.25,14.8 R1.1
N$3  (via drill 0.3)
  Top 0.152: v21.6,13.35 21.15,13.35 IC1.1 | R2.8 47.68,14.41 v46.88,13.61
  Bottom 0.152: v21.6,13.35 22.36,13.35 23.23,14.21 30.09,14.21 32.16,16.29 43.29,16.29 44.21,15.36 44.21,15.01 45.35,13.88 46.61,13.88 v46.88,13.61
N$4  (via drill 0.3)
  Top 0.152: IC1.2 21.05,14.34 21.5,13.9 v22.15,13.9 | R2.7 47.12,14.98 v46.55,14.41
  Bottom 0.152: v46.55,14.41 46.19,14.41 45.96,14.19 45.5,14.19 44.52,15.16 44.52,15.5 43.42,16.6 32.02,16.6 29.95,14.52 22.77,14.52 v22.15,13.9
N$5  (via drill 0.3)
  Top 0.152: IC1.3 21.3,14.84 v21.6,14.55 | R2.6 v45.74,14.73
  Bottom 0.152: v21.6,14.55 22.3,14.55 22.59,14.84 29.82,14.84 31.9,16.91 43.56,16.91 44.86,15.61 44.86,15.29 45.17,14.98 45.49,14.98 v45.74,14.73
N$6
  Top 0.152: IC1.19 14.96,16.34 14.5,16.8 13.2,16.8 C2.1
  Top 0.406: C1.1 C2.1
N$7
  Top 0.152: IC1.23 14.76,14.34 14.35,14.75 13.21,14.75 C3.1
  Top 0.406: C4.1 C3.1
N$8
  Top 0.152: IC1.26 16.95,12.5 16.6,12.15 14.95,12.15 14.75,11.95 13.35,11.95 13.18,11.78 R21.2
N$9  (via drill 0.3)
  Top 0.152: IC1.4 21.2,15.34 21.4,15.15 v22.15,15.15 | R2.5 v45.4,15.51
  Bottom 0.152: v45.4,15.51 43.69,17.23 31.75,17.23 29.68,15.15 v22.15,15.15
N$10  (via drill 0.3)
  Top 0.152: IC1.20 14.65,15.84 v14.4,16.1
  Top 0.406: R6.1 v27.05,19.45 C22.1
  Bottom 0.152: v14.4,16.1 14.57,15.92 21.02,15.92 21.4,16.3 21.82,16.3 22.05,16.08 22.57,16.08 25.38,18.88 26.5,18.88 27.05,19.42 v27.05,19.45
N$12
  Top 0.152: IC1.12 18.45,18.22 arc-45 18.8,19.05 arc45 19.01,19.51 C17.1
  Top 0.305: C17.1 R4.2
N$13
  Top 0.152: IC1.13 17.95,18.31 arc45 17.65,19.05 arc-45 17.46,19.63 C18.1
  Top 0.305: 17.46,20.39 C18.1 R5.2
N$14
  Top 0.305: 17.56,21.59 C18.2
  Top 0.406: FL1.4 17.56,21.59
N$15
  Top 0.305: 18.88,21.61 C17.2
  Top 0.406: FL1.6 18.88,21.61
N$16
  Top 0.152: C23.2 25.86,18.48 26.05,18.3 26.05,17.85 26.25,17.65 27.85,17.65 28.05,17.85 28.05,18.3 28.25,18.5 29.04,18.5 R7.2
N$18
  Top 0.406: FL1.2 18.23,27.38 AT1.1
N$19
  Top 0.406: R20.1 57.59,27.35 57.59,27.67 LED1.A
N$20
  Top 0.152: C26.2 61.25,21.41 60.84,21.41 Y1.3 59.66,21.34 59.45,21.34 59.19,21.6 58.93,21.6 U1.7
N$21
  Top 0.152: 57.62,21.43 U1.8 57.8,21.6 58.35,22.15 58.6,22.15 58.74,22.01 59.03,22.01 60.34,23.32 60.34,23.67 59.98,24.03 59.98,24.31 60.57,24.9 | 60.57,24.9 Y1.1 | 60.57,24.9 60.04,25.42 59.65,25.42 C27.2
N$22
  Top 0.305: IC2.2 75.5,14.41 75.89,14.79 77.47,14.79 77.84,14.43 77.84,13.39 78.15,13.07 R16.1
N$23
  Top 0.305: R23.2 32.72,13.07 IC3.1
  Top 0.406: C40.2 R24.1 32.95,11.2 IC3.1
N$24  (via drill 0.3)
  Top 0.305: R16.2 80.09,14.77 81.01,15.7 81.01,17.19 L1.2 81,16.27 v81.03,16.25 | v82.12,20.4 C34.1 C35.1 79.02,20.44 77.95,20.44 77.01,21.38 76.58,21.38 76.16,20.96 IC2.6
  Bottom 0.305: v81.03,16.25 81.03,19.3 v82.12,20.4
N$25
  Top 0.305: IC3.2 33.6,15.92 32.75,16.77 R15.1
  Top 0.406: R15.1
N$27
  Top 0.254: C31.1
  Top 0.406: C32.1 C31.1 | 31.05,20.53 C32.1 | C32.1 31.62,20.4 32.06,20.84 L2.2 32.89,20.84 33.38,20.35 34.05,20.35 34.25,20.15 IC3.6 | R15.2 30.9,20.39 C32.1
N$28  (via drill 0.3)
  Top 0.305: IC4.6 94.34,19.05 v94,19.4 93.95,19.45 C38.1 94,20.36 | v95.65,19.2 v95.64,19.2 IC4.4 95.64,18.73
  Top 0.406: L3.2 94.07,22.45 C36.1 C38.1
  Bottom 0.305: v94,19.4 95.45,19.4 v95.65,19.2
N$29
  Top 0.152: R19.1 94.96,10.29 94.81,10.44 94.81,15 95.06,15.25 95.4,15.25 95.65,15.5 IC4.3
N$30  (via drill 0.3)
  Top 0.406: IC6.6 v26.12,9.32 25.6,9.32 25.15,9.32 C43.1 | R24.2 v32.1,9.43
  Bottom 0.406: v32.1,9.43 26.23,9.43 v26.12,9.32
NEG_SILK
  pour Top: 29.12,-21.12 37.25,-21.12 arc90 38.25,-20.12 arc90 37.25,-19.12 29.12,-19.12 arc90 28.12,-20.12 arc90
PPS_IN  (via drill 0.3)
  Top 0.305: v74.9,3.69 J6.6 | J6.6 v74.9,2.29 v74.9,0.62 | 74.85,2.35 74.85,0.52 74.88,0.5 74.88,0.62 | 74.88,0.62 74.88,3.85 74.85,3.88 | J6.6 74.9,0.65 74.88,0.62
  Top 0.406: 74.85,12.15 74.85,13.63 IC2.1
  Top 0.813: 74.85,12.15 74.85,3.88 74.85,2.35 J6.6
  Bottom 0.305: J6.6 v74.9,0.62 | J6.6 74.9,3.45 74.85,3.5 74.85,2.35 J6.6
PPS_PLL  (via drill 0.3)
  Top 0.152: v36.59,13.61 37.16,13.61 37.75,13.02 37.75,10.75 v38.17,10.32 | v40.26,7.07 40.5,7.3 50.92,7.3 51.39,6.84 53.6,6.84 v55.1,8.4
  Top 0.305: v76.17,10.7 76.17,13.28 arc90 IC2.3
  Bottom 0.152: JP1.3 20.38,9.5 21.12,8.75 32.69,8.75 34.31,10.38 34.31,12.01 35.51,13.21 36.4,13.21 36.59,13.4 v36.59,13.61 | v40.26,7.07 40.26,8.5 38.44,10.32 v38.17,10.32
  Bottom 0.813: v55.1,8.4 73.81,8.4 arc90 v76.17,10.7
PPS_RPI  (via drill 0.3)
  Top 0.152: IC7.3 65.5,13.88 65.83,13.88 66.53,14.58 66.53,15.89 68.28,17.64 73.41,17.64 73.42,17.62 | 72.8,17.62 73.42,17.62 | 73.42,17.62 76.28,17.62 76.79,18.14 76.79,19.16 | 76.79,19.16 IC2.5 | 76.79,19.16 76.79,19.62 76.78,19.64
  Top 0.254: 76.78,19.64 76.78,19.69 | 76.78,19.69 76.78,20.2 | v76.79,20.71 76.79,19.7 arc-90 76.78,19.69
  Top 0.406: v88.12,16.75 86.18,18.69 arc45 84.39,19.44 v78.19,19.44
  Bottom 0.152: J8.7 103.47,15
  Bottom 0.254: v78.19,19.44 78.06,19.44
  Bottom 0.406: 78.06,19.44 arc-90 v76.79,20.71
  Bottom 0.813: J8.7 90.93,15 arc-45 89.13,15.74 v88.12,16.75
PPS_USRP  (via drill 0.3)
  Top 0.305: v74.9,83.33 J1.6 | 74.9,81.3 v74.9,80.29
  Top 0.406: IC2.8 74.86,20.54 74.86,20.17
  Top 0.813: 74.9,81.3 J1.6 74.86,81.61 74.86,20.54
  other vias: 74.9,81.65
RESET  (via drill 0.3)
  Top 0.152: v56.3,16.78 57.11,16.78 U1.29 60.56,13.33 60.56,13.26 61.11,12.71 61.11,12.25 60.74,11.88 60.74,11.67 61.32,11.09 R12.1
  Bottom 0.152: v56.3,16.78 v56.3,16.77 TP3.TP
RF_OUT  (via drill 0.3)
  Top 0.305: J3.6 18.29,31.77 v18.23,33.19 18.23,32.25 J3.6 | v18.23,30.31 v18.23,31.7 J3.6
  Top 0.406: AT1.2 18.21,31.99 J3.6
  Bottom 0.305: v18.23,33.19 18.21,32.76 18.21,30.38 18.24,30.4 v18.23,30.31 J3.6
RFOUT_EN  (via drill 0.3)
  Top 0.152: U1.11 54,21.02 54,21.27 54.39,21.66 54.39,22.23 54.8,22.64 v54.8,23.01 | v44.8,17.17 44.8,16.19 44.49,15.88 44.49,14.1 v43.98,13.59 | v14.24,10.29 14.24,9.73 13.94,9.43 R21.1
  Bottom 0.152: v54.8,23.01 54.27,22.49 53.46,22.49 51.7,20.73 51.7,20.39 51.27,19.96 48.26,19.96 45.48,17.17 v44.8,17.17 | v43.98,13.59 43.98,14.35 43.59,14.74 43.59,15.09 43.02,15.65 32.42,15.65 30.35,13.57 23.46,13.57 22.61,12.73 22.19,12.73 21.95,12.49 21.24,12.49 20.02,13.7 16.41,13.7 15.81,13.1 15.81,11.86 v14.24,10.29
SCL  (via drill 0.3)
  Top 0.152: U1.28 60.26,12.5 v60.55,12.5 | v70,10 68.92,10 v68.8,10.12 68.56,10.36 64.81,10.36 64.09,9.64 R18.1
  Bottom 0.152: v60.55,12.5 60.76,12.71 61.64,12.71 63.99,10.36 68.56,10.36 v68.8,10.12 | J8.5 103.5,17.01 102.81,17.7 84.81,17.7 81.75,14.64 73.99,14.64 70,10.65 v70,10
SDA  (via drill 0.3)
  Top 0.152: U1.27 59.69,11.93 v59.98,11.93 60.19,11.73 60.19,11 58.56,9.38 58.56,9.19 59.06,8.68 R17.1
  Bottom 0.152: v59.98,11.93 60.76,11.93 61.22,12.39 61.47,12.39 62.67,11.19 62.67,10.84 63.46,10.05 68.09,10.05 68.59,9.55 69.03,9.55 69.38,9.9 69.38,10.48 73.88,14.98 81.62,14.98 84.66,18.01 104.5,18.01 105.49,19 J8.4
SW  (via drill 0.3)
  Top 0.152: R7.1 29,16 28.75,15.75 v27.45,15.75 27.3,15.75 27.05,15.5 R8.2 27.02,14.8 | IC1.5 21.45,15.84 v21.6,15.75
  Bottom 0.152: v27.45,15.75 27.15,16.05 23.05,16.05 22.75,15.75 v21.6,15.75

### Text on the board
tNames: PPS IN
bNames: Techtile PLL / Version 1 - 14/11/23 / by G. Leenders / dramco.be/techtile | ICSP | MISO | MUX | PPS
tRestrict: SWITCH BOARD